# Altium project Fuel_Dispenser_Controller_V1.0.0.PrjPcb (part 2 of 2)

## Sheet Power_Board.SchDoc: MAIN POWER 5V / 3V3 / 1V8
size A2; Date: Not used; ApprovedBy: Not used; CheckedBy: Not used; Author: Not used; CompanyName: STMicroelectronics; DrawnBy: Not used; Engineer: Not used; Organization: Not used; Address1: Not used; Address2: Not used; Address3: Not used; Address4: Not used; DocumentNumber: 9; Revision: Not used; SheetNumber: 5; SheetTotal: 10; CurrentTime: Not used; CurrentDate: Not used; Time: Not used; DocumentFullPathAndName: Not used; DocumentName: Not used; ModifiedDate: Not used; ImagePath: Not used; ProjectName: Not used; Application_BuildNumber: Not used
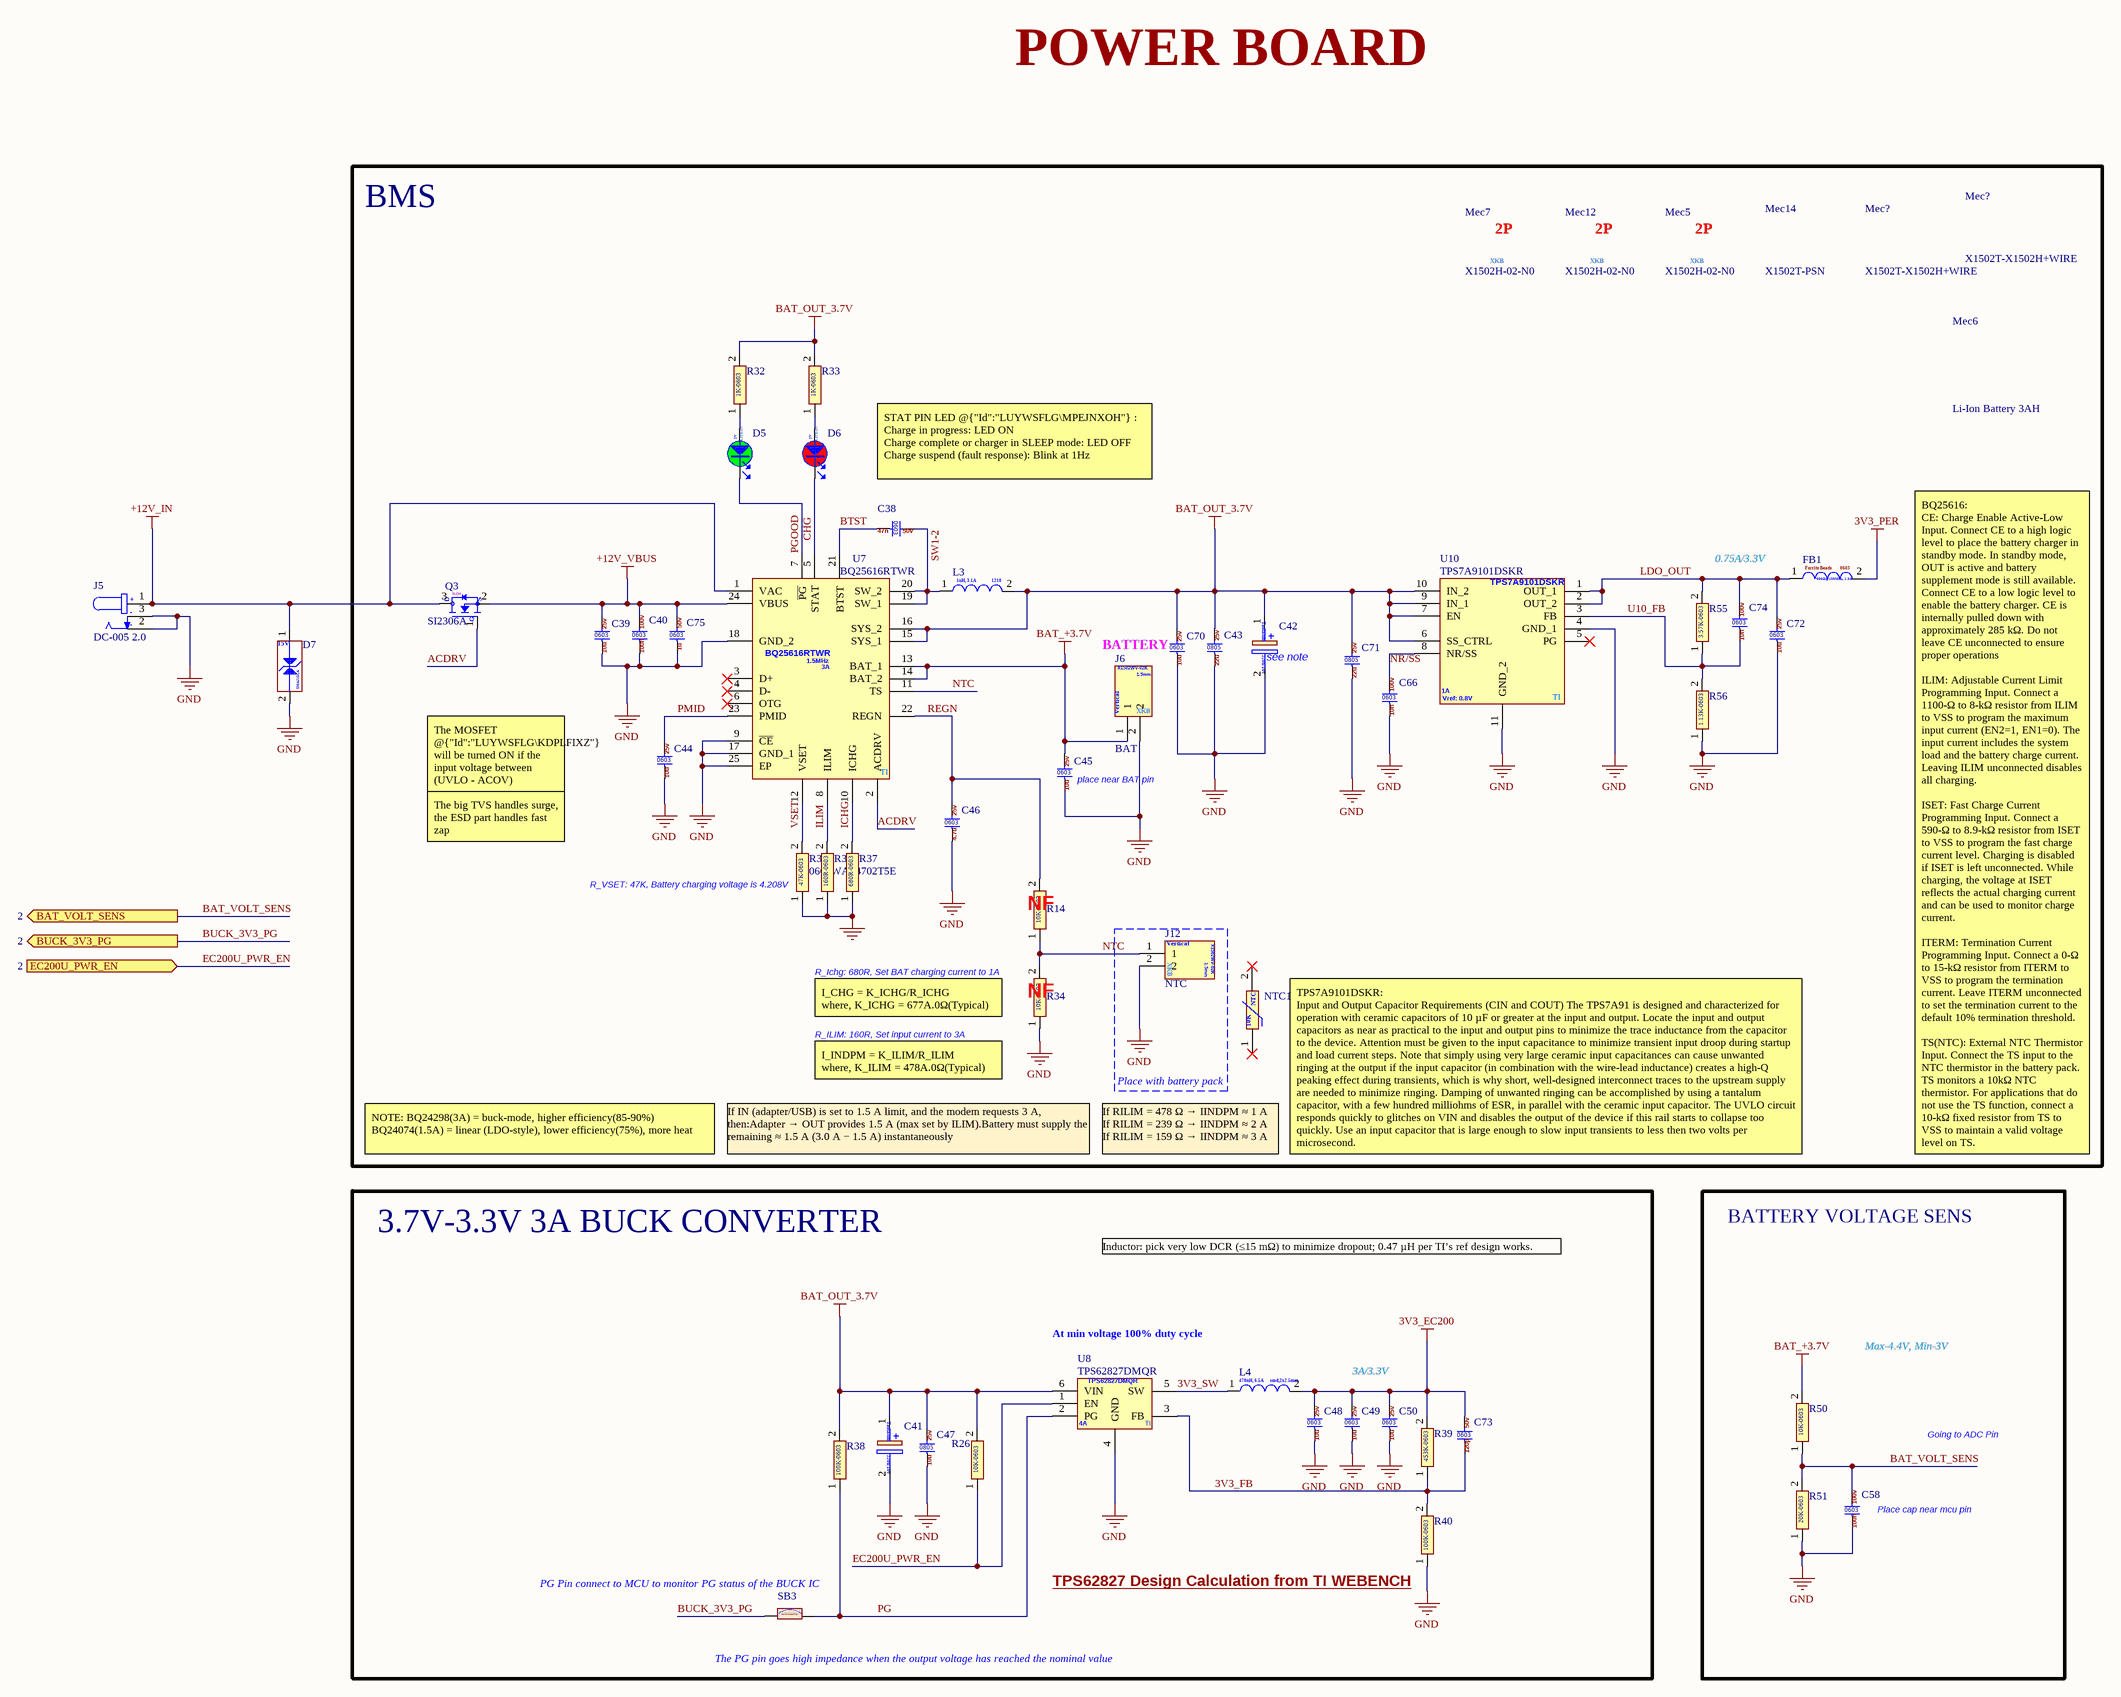
[diagram p5: Power_Board.SchDoc]

### Parts
(Parts that share a designator on the sheet are numbered #1, #2 ... from top to bottom, then left to right.)
C38  CL10B473KB8NNNC  [0603-CAP]  (value not drawn)
C39  CL10A106MA8NRNC  [0603-CAP]  (value not drawn)
C40  CL10B104KC8NNNC  [0603-CAP]  (value not drawn)
C41  TAJD227K010RNJ  [CASE-D-7343]  (value not drawn)
C42  TAJD227K010RNJ  [CASE-D-7343]  (value not drawn)
C43  CL21A226MAQNNNE  [0805-CAP]  (value not drawn)
C44  CL10A106MA8NRNC  [0603-CAP]  (value not drawn)
C45  CL10A106MA8NRNC  [0603-CAP]  (value not drawn)
C46  CL10A475KA8NQNC  [0603-CAP]  (value not drawn)
C47  CL21A106KAYNNNE  [0805-CAP]  (value not drawn)
C48  CL10A106MA8NRNC  [0603-CAP]  (value not drawn)
C49  CL10A106MA8NRNC  [0603-CAP]  (value not drawn)
C50  CL10A106MA8NRNC  [0603-CAP]  (value not drawn)
C58  CL10B104KC8NNNC  [0603-CAP]  (value not drawn)
C66  CL10B103KC8WPNC  [0603-CAP]  (value not drawn)
C70  CL10A106MA8NRNC  [0603-CAP]  (value not drawn)
C71  CL21A226MAQNNNE  [0805-CAP]  (value not drawn)
C72  CL10A106MA8NRNC  [0603-CAP]  (value not drawn)
C73  CL10C121JB81PNC  [0603-CAP]  (value not drawn)
C74  CL10B103KC8WPNC  [0603-CAP]  (value not drawn)
C75  CL10A105KB8NNNC  [0603-CAP]  (value not drawn)
D5  LTST-C170KGKT  [0805-LED-BLUE]  (value not drawn)
D6  LTST-C170KRKT  [0805-LED-RED]  (value not drawn)
D7  SMAJ15CA  [SMA (DO-214AC)]  (value not drawn)
FB1  BLM18KG601SN1D  [Ferrite Beads 0603]  (value not drawn)
J5  DC-005 2.0  [DC JACK]
J6  BAT  [JST 2P 1.5MM VERTICAL]
J12  NTC  [JST 2P 1.5MM VERTICAL]
L3  1277AS-H-1R0M=P2  [IND-1210]  (value not drawn)
L4  FTC252012SR47MBCA  [IND SMD,2x2.5mm]  (value not drawn)
Mec5  X1502H-02-N0  (mechanical)
Mec6  Li-Ion Battery 3AH  (mechanical)
Mec7  X1502H-02-N0  (mechanical)
Mec12  X1502H-02-N0  (mechanical)
Mec14  X1502T-PSN  (mechanical)
Mec?#1  X1502T-X1502H+WIRE  (mechanical)
Mec?#2  X1502T-X1502H+WIRE  (mechanical)
NTC1  NXRT15XH103FA1B030  [NXRT15XH103FA1B030]  (value not drawn)  (mechanical)
Q3  SI2306A  [SOT-23-3]
R14  0603WAF1002T5E  [0603-RES]  (value not drawn)
R26  0603WAF1002T5E  [0603-RES]  (value not drawn)
R32  0603WAF1001T5E  [0603-RES]  (value not drawn)
R33  0603WAF1001T5E  [0603-RES]  (value not drawn)
R34  0603WAF1002T5E  [0603-RES]  (value not drawn)
R35  0603WAF4702T5E  [0603-RES]
R36  0603WAF1600T5E  [0603-RES]  (value not drawn)
R37  0603WAF6800T5E  [0603-RES]  (value not drawn)
R38  0603WAF1003T5E  [0603-RES]  (value not drawn)
R39  0603WAF4533T5E  [0603-RES]  (value not drawn)
R40  0603WAF1003T5E  [0603-RES]  (value not drawn)
R50  0603WAF1002T5E  [0603-RES]  (value not drawn)
R51  0603WAF2002T5E  [0603-RES]  (value not drawn)
R55  0603WAF3571T5E  [0603-RES]  (value not drawn)
R56  0603WAF1131T5E  [0603-RES]  (value not drawn)
SB3  0603WAF0000T5E  [SOLDER-BRIDGE_R0603-0R]  (value not drawn)
U7  BQ25616RTWR  [QFN-24-EP(4x4)]
U8  TPS62827DMQR  [VSON-6(1.5x1.5) - TPS62826DMQR]
U10  TPS7A9101DSKR  [SON-10-EP(2.5x2.5)]

### Blocks framed on the sheet
BMS: C38-C40 C42-C46 C66 C70-C72 C74 C75 D5 D6 FB1 J6 L3 Mec5-Mec7 Mec12 Mec14 Mec?#1 Mec?#2 NTC1 Q3 R14 R32-R37 R55 R56 U7 U10
Place with battery pack: J12
3.7V-3.3V 3A BUCK CONVERTER: C41 C47-C50 C73 L4 R26 R38-R40 SB3 U8
BATTERY VOLTAGE SENS: C58 R50 R51

### Ports
BAT_VOLT_SENS (out, see 2), BUCK_3V3_PG (out, see 2), EC200U_PWR_EN (in, see 2)

### Nets
3V3_EC200: C48.2 C49.2 C50.2 C73.2 L4.2 R39.2
3V3_PER: FB1.2  [project net 3V3_MCU]
+12V_IN: D7.1(IO1) J5.1 Q3.3(D) U7.1(VAC)
+12V_VBUS: C39.2 C40.2 C75.2 Q3.2(S) U7.24(VBUS)
BAT_+3.7V: C45.2 J6.1 R50.2 U7.13(BAT_1) U7.14(BAT_2)
BAT_OUT_3.7V: C41.1(+) C42.1(+) C43.2 C47.2 C70.2 C71.2 L3.2 R26.2 R32.2 R33.2 R38.2 U7.15(SYS_1) U7.16(SYS_2) U8.6(VIN) U10.6(SS_CTRL) U10.7(EN) U10.9(IN_1) U10.10(IN_2)
GND: C39.1 C40.1 C41.2(-) C42.2(-) C43.1 C44.1 C45.1 C46.1 C47.1 C48.1 C49.1 C50.1 C58.1 C66.1 C70.1 C71.1 C72.1 C75.1 D7.2(GND) J5.2 J5.3 J6.2 J12.2 R34.1 R35.1 R36.1 R37.1 R40.1 R51.1 R56.1 U7.9(~{CE}) U7.17(GND_1) U7.18(GND_2) U7.25(EP) U8.4(GND) U10.4(GND_1) U10.11(GND_2)
3V3_FB: C73.1 R39.1 R40.2 U8.3(FB)  [project net 3V3_FB_5]
3V3_SW: L4.1 U8.5(SW)  [project net 3V3_SW_5]
ACDRV: Q3.1(G) U7.2(ACDRV)  [project net ACDRV_5]
BAT_VOLT_SENS: C58.2 R50.1 R51.2 ; port BAT_VOLT_SENS
BTST: C38.1 U7.21(BTST)  [project net BTST_5]
BUCK_3V3_PG: SB3.1 ; port BUCK_3V3_PG
CHG: D6.2 U7.5(STAT)  [project net CHG_5]
EC200U_PWR_EN: R26.1 U8.1(EN) ; port EC200U_PWR_EN
ICHG: R37.2 U7.10(ICHG)  [project net ICHG_5]
ILIM: R36.2 U7.8(ILIM)  [project net ILIM_5]
LDO_OUT: C72.2 C74.2 FB1.1 R55.2 U10.1(OUT_1) U10.2(OUT_2)  [project net LDO_OUT_5]
NR/SS: C66.2 U10.8(NR/SS)  [project net NR/SS_5]
NTC: J12.1 R14.1 R34.2 U7.11(TS)  [project net NTC_5]
PG: R38.1 SB3.2 U8.2(PG)  [project net PG_5]
PGOOD: D5.2 U7.7(~{PG})  [project net PGOOD_5]
PMID: C44.2 U7.23(PMID)  [project net PMID_5]
REGN: C46.2 R14.2 U7.22(REGN)  [project net REGN_5]
SW1-2: C38.2 L3.1 U7.19(SW_1) U7.20(SW_2)  [project net SW1-2_5]
U10_FB: C74.1 R55.1 R56.2 U10.3(FB)  [project net U10_FB_5]
VSET: R35.2 U7.12(VSET)  [project net VSET_5]
NetD5_1: D5.1 R32.1
NetD6_1: D6.1 R33.1

Not connected (* = marked no-connect by the designer): NTC1 1* 2*; U7 3(D+)* 4(D-)* 6(OTG)*; U10 5(PG)*

### Notes on the sheet
- POWER BOARD
- STAT PIN LED @{"Id":"LUYWSFLG\MPEJNXOH"} :
  Charge in progress: LED ON
  Charge complete or charger in SLEEP mode: LED OFF
  Charge suspend (fault response): Blink at 1Hz
- 0.75A/3.3V
- (near C70) BATTERY
- (near C42) see note
- The MOSFET @{"Id":"LUYWSFLG\KDPLFIXZ"} will be turned ON if the input voltage between (UVLO - ACOV)
  ACOV: 14.2-V
- (near C45) place near BAT pin
- The big TVS handles surge, the ESD part handles fast zap
- (near R35) R_VSET: 47K, Battery charging voltage is 4.208V
- (near R14) NF
- (near R34) R_Ichg: 680R, Set BAT charging current to 1A
- (near R34) NF
- R_ILIM: 160R, Set input current to 3A
- (near R34) I_CHG = K_ICHG/R_ICHG
  where, K_ICHG = 677A.0Ω(Typical)
- (near R34) I_INDPM = K_ILIM/R_ILIM
  where, K_ILIM = 478A.0Ω(Typical)
- NOTE: BQ24298(3A) = buck-mode, higher efficiency(85-90%)
  BQ24074(1.5A) = linear (LDO-style), lower efficiency(75%), more heat
- If IN (adapter/USB) is set to 1.5 A limit, and the modem requests 3 A, then:Adapter → OUT provides 1.5 A (max set by ILIM).Battery must supply the remaining ≈ 1.5 A (3.0 A − 1.5 A) instantaneously
- If RILIM = 478 Ω → IINDPM ≈ 1 A
  If RILIM = 239 Ω → IINDPM ≈ 2 A
  If RILIM = 159 Ω → IINDPM ≈ 3 A
- (near NTC1) TPS7A9101DSKR:
  Input and Output Capacitor Requirements (CIN and COUT) The TPS7A91 is designed and characterized for operation with ceramic capacitors of 10 µF or greater at the input and output. Locate the input and output capacitors as near as practical to the input and output pins to minimize the trace inductance from the capacitor to the device. Attention must be given to the input capacitance to minimize transient input droop during startup and load current steps. Note that simply using very large ceramic input capacitances can cause unwanted ringing at the output if the input capacitor (in combination with the wire-lead inductance) creates a high-Q peaking effect during transients, which is why short, well-designed interconnect traces to the upstream supply are needed to minimize ringing. Damping of unwanted ringing can be accomplished by using a tantalum capacitor, with a few hundred milliohms of ESR, in parallel with the ceramic input capacitor. The UVLO circuit responds quickly to glitches on VIN and disables the output of the device if this rail starts to collapse too quickly. Use an input capacitor that is large enough to slow input transients to less then two volts per microsecond.
- BQ25616:
  CE: Charge Enable Active-Low Input. Connect CE to a high logic level to place the battery charger in standby mode. In standby mode, OUT is active and battery supplement mode is still available. Connect CE to a low logic level to enable the battery charger. CE is internally pulled down with approximately 285 kΩ. Do not leave CE unconnected to ensure proper operations
  ILIM: Adjustable Current Limit Programming Input. Connect a 1100-Ω to 8-kΩ resistor from ILIM to VSS to program the maximum input current (EN2=1, EN1=0). The input current includes the system load and the battery charge current. Leaving ILIM unconnected disables all charging.
  ISET: Fast Charge Current Programming Input. Connect a 590-Ω to 8.9-kΩ resistor from ISET to VSS to program the fast charge current level. Charging is disabled if ISET is left unconnected. While charging, the voltage at ISET reflects the actual charging current and can be used to monitor charge current.
  ITERM: Termination Current Programming Input. Connect a 0-Ω to 15-kΩ resistor from ITERM to VSS to program the termination current. Leave ITERM unconnected to set the termination current to the default 10% termination threshold.
  TS(NTC): External NTC Thermistor Input. Connect the TS input to the NTC thermistor in the battery pack. TS monitors a 10kΩ NTC thermistor. For applications that do not use the TS function, connect a 10-kΩ fixed resistor from TS to VSS to maintain a valid voltage level on TS.
- Inductor: pick very low DCR (≤15 mΩ) to minimize dropout; 0.47 µH per TI’s ref design works.
- At min voltage 100% duty cycle
- 3A/3.3V
- Max-4.4V, Min-3V
- Going to ADC Pin
- (near C58) Place cap near mcu pin
- (near SB3) PG Pin connect to MCU to monitor PG status of the BUCK IC
- (near R40) TPS62827 Design Calculation from TI WEBENCH <https://webench.ti.com/power-designer/switching-regulator/customize/15>
- (near SB3) The PG pin goes high impedance when the output voltage has reached the nominal value
- Title:
- Project:
- Size:
- Revision:
- Variant:
- A4
- -
- Date:
- Reference:
- Sheet:
- of
- (in symbol 0603WAF1001T5E) 1K-0603
- (in symbol 0603WAF1002T5E) 10K-0603
- (in symbol 0603WAF1003T5E) 100K-0603
- (in symbol 0603WAF1131T5E) 1.13K-0603
- (in symbol 0603WAF1600T5E) 160R-0603
- (in symbol 0603WAF2002T5E) 20K-0603
- (in symbol 0603WAF3571T5E) 3.57K-0603
- (in symbol 0603WAF4533T5E) 453K-0603
- (in symbol 0603WAF4702T5E) 47K-0603
- (in symbol 0603WAF6800T5E) 680R-0603
- (in symbol 1277AS-H-1R0M=P2) 1uH, 3.1A; 1210
- (in symbol BLM18KG601SN1D) Ferrite Beads; 0603; 600Ω@100MHz, 1.3A
- (in symbol BQ25616RTWR) 1.5MHz; 3A; TI
- (in symbol CL10A105KB8NNNC) 50v; 0603; 1u
- (in symbol CL10A106MA8NRNC) 25v; 0603; 10u
- (in symbol CL10A475KA8NQNC) 25v; 0603; 4.7u
- (in symbol CL10B103KC8WPNC) 100v; 0603; 10n
- (in symbol CL10B104KC8NNNC) 100v; 0603; 100n
- (in symbol CL10B473KB8NNNC) 0603; 47n; 50v
- (in symbol CL10C121JB81PNC) 50v; 0603; 120p
- (in symbol CL21A106KAYNNNE) 25v; 0805; 10u
- (in symbol CL21A226MAQNNNE) 25v; 0805; 22u
- (in symbol DC-005 2.0) +; -
- (in symbol FTC252012SR47MBCA) 470nH, 6.5A; smd,2x2.5mm
- (in symbol LTST-C170KGKT) 2V; LITEON
- (in symbol LTST-C170KRKT) 2V; LITEON
- (in symbol NXRT15XH103FA1B030) NTC; 10K
- (in symbol SI2306A) N-CH
- (in symbol SMAJ15CA) 15V
- (in symbol TAJD227K010RNJ) Tantalum; 220u/10v
- (in symbol TPS7A9101DSKR) 1A; Vref: 0.8V; TI
- (in symbol TPS62827DMQR) 4A; TI
- (in symbol X1502H-02-N0) 2P; XKB
- (in symbol X1502WV-02K-N0SN) X1502WV-02K; 1.5mm; Vertical; XKB

### Library data of the parts
C38 = CL10B473KB8NNNC: CAP: CER 47NF 50V X7R 0603; POC Price: 0.0051; LCSC Part #: C1622; Unit Price: 0.0031; ComponentLink1Description: DS; ComponentLink1URL: https://www.lcsc.com/datasheet/C1588.pdf
C39 C44 C45 C48-C50 C70 C72 = CL10A106MA8NRNC: CAP: CER 10UF 25V X5R 0603; LCSC Part #: C96446; Unit Price: 0.01; ComponentLink1Description: DS; ComponentLink1URL: https://www.lcsc.com/datasheet/C96446.pdf
C40 C58 = CL10B104KC8NNNC: as C3 on sheet MCU; LCSC Part #: C15725; Unit Price: 0.0036; ComponentLink1Description: DS; ComponentLink1URL: https://www.lcsc.com/datasheet/C15725.pdf
C41 C42 = TAJD227K010RNJ: CAP: TANT 220uF ±10% 10V CASE-D-7343; POC Price: 0.3941; LCSC Part #: C8024; Unit Price: 0.2118
C43 C71 = CL21A226MAQNNNE: CAP: CER 22UF 25V X5R 0805; LCSC Part #: C45783; Unit Price: 0.0136
C46 = CL10A475KA8NQNC: CAP: CER 4.7UF 25V X5R 0603; POC Price: 0.0167; LCSC Part #: C69335; Unit Price: 0.009; ComponentLink1Description: DS; ComponentLink1URL: https://www.lcsc.com/datasheet/C69335.pdf
C47 = CL21A106KAYNNNE: CAP: CER 10UF 25V X5R 0805; LCSC Part #: C15850; Unit Price: 0.0059
C66 C74 = CL10B103KC8WPNC: CAP: CER 10NF 100V X7R 0603; LCSC Part #: C307347; Unit Price: 0.0046
C73 = CL10C121JB81PNC: CAP: CER 120PF 50V C0G 0603; POC Price: 0.011; LCSC Part #: C444883; Unit Price: 0.0048
C75 = CL10A105KB8NNNC: CAP: CER 1UF 50V X5R 0603; LCSC Part #: C15849; Unit Price: 0.0026
D5 = LTST-C170KGKT: as D4 on sheet miniPCIe_EC200U; LCSC Part #: C98221; Unit Price: 0.0095; ComponentLink1Description: DS; ComponentLink1URL: https://www.lcsc.com/datasheet/C98221.pdf
D6 = LTST-C170KRKT: as D3 on sheet miniPCIe_EC200U; LCSC Part #: C94868; Unit Price: 0.0107
D7 = SMAJ15CA: DIODE ESD: 16.4A@10/1000us 400W@10/1000us 24.4V 18.5V Bidirectional 15V DO-214AC(SMA) ESD and Surge Protection (TVS/ESD) ROHS; POC Price: 0.0378; LCSC Part #: C110044; Unit Price: 0.0178; ComponentLink1Description: DS; ComponentLink1URL: https://www.lcsc.com/datasheet/C110044.pdf
FB1 = BLM18KG601SN1D: Ferrite Beads: 150mΩ 600Ω@100MHz 1.3A muRata; POC Price: 0.0113; LCSC Part #: C85833; Unit Price: 0.0059; ComponentLink1Description: DS; ComponentLink1URL: https://www.lcsc.com/datasheet/C85833.pdf
J5 = DC-005 2.0: CONN: Right Angle DC Power Jack -25℃~+85℃ 2mm 6.4mm 1A 12V Through Hole DC Power Connectors ROHS; LCSC Part #: C16214
J6 J12 = X1502WV-02K-N0SN: JST: Vertical, P1.5mm TH, 2P, Wire To Board Connector, 1A (Housing: X1502H-02-N0 - C697053); POC Price: 0.0156; LCSC Part #: C561525; Unit Price: 0.0071; ComponentLink1Description: DS; ComponentLink1URL: https://www.lcsc.com/datasheet/C561525.pdf
L3 = 1277AS-H-1R0M=P2: INDUCTOR: 1uH 3.1A 45mΩ 1210 FIXED IND; POC Price: 0.1051; LCSC Part #: C237284; ComponentLink1Description: DS; ComponentLink1URL: https://www.lcsc.com/datasheet/C237284.pdf; Unit Price: 0.0566
L4 = FTC252012SR47MBCA: INDUCTOR: FIXED IND 0.47uH 6.5A 13mΩ SMD,2x2.5mm; POC Price: 0.0806; LCSC Part #: C5832368; Unit Price: 0.0393; ComponentLink1Description: DS; ComponentLink1URL: https://www.lcsc.com/datasheet/C167222.pdf
Mec5 Mec7 Mec12 = X1502H-02-N0: JST Housing: P1.5mm, 2P, Wire To Board; POC Price: 0.0042; LCSC Part #: C697053; Unit Price: 0.0036; ComponentLink1Description: DS; ComponentLink1URL: https://www.lcsc.com/datasheet/C697053.pdf
Mec6 = Li-Ion Battery 3AH: Battery: Li ion, Li-ion 3ah; Parameter 1: *
Mec14 = X1502T-PSN: Con: Rectangular Connector Contacts ROHS; JST; HOUSING; P1.5mm; 2P; 3P; 4P; WIRE TO BOARD; X1502H; X1503H; X1504H; X1505H; X1506H; X1502T; X1503T; X1504T; X1505T; X1506T; POC Price: 0.005; LCSC Part #: C780064; Unit Price: 0.0024; ComponentLink1Description: DS; ComponentLink1URL: https://www.lcsc.com/datasheet/C780064.pdf
Mec?#1 Mec?#2 = X1502T-PSN-A28RB-L100-T3: Hook-Up Wire: Housing+contact; Single Conductor Cables (Hook-Up Wire); JST; HOUSING; P1.5mm; 2P; WIRE TO BOARD; X1502H; X1502T; 28 AWG; POC Price: 0.0789; LCSC Part #: C6118644; Unit Price: 0.0727; ComponentLink1Description: DS
NTC1 = NXRT15XH103FA1B030: NTC: 10kΩ 7.5mW 3380K ±1% Through Hole,P=2.5mm NTC Thermistors ROHS; POC Price: 0.3195; ComponentLink1Description: DS; ComponentLink1URL: https://componentsearchengine.com/Datasheets/1/NXRT15XH103FA1B030.pdf; LCSC Part #: C152559; Unit Price: 0.1511
Q3 = SI2306A: MOSFET: N-CH 30V 4A 1.25W 35mΩ@10V 3V@250uA 1 N-Channel SOT-23 MOSFETs ROHS; LCSC Part #: C347489; Unit Price: 0.0155
R14 R26 R34 R50 = 0603WAF1002T5E: RES: 10K OHM 1% 100mW 0603 75V; LCSC Part #: C25804; Unit Price: 0.0005; ComponentLink1Description: DS; ComponentLink1URL: https://www.lcsc.com/datasheet/C25804.pdf
R32 R33 = 0603WAF1001T5E: RES: 1K OHM 1% 100mW 0603 75V; LCSC Part #: C21190; Unit Price: 0.0005; ComponentLink1Description: DS; ComponentLink1URL: https://www.lcsc.com/datasheet/C21190.pdf
R35 = 0603WAF4702T5E: RES: 47K OHM 1% 100mW 0603 75V; LCSC Part #: C25819; Unit Price: 0.0006; ComponentLink1Description: DS; ComponentLink1URL: https://www.lcsc.com/datasheet/C25819.pdf
R36 = 0603WAF1600T5E: RES: 160R OHM 1% 100mW 0603 75V; POC Price: 0.0011; LCSC Part #: C22814; Unit Price: 0.0006; ComponentLink1Description: DS; ComponentLink1URL: https://www.lcsc.com/datasheet/C22787.pdf
R37 = 0603WAF6800T5E: RES: 680R OHM 1% 100mW 0603 75V; POC Price: 0.0011; LCSC Part #: C23228; Unit Price: 0.0006; ComponentLink1Description: DS; ComponentLink1URL: https://www.lcsc.com/datasheet/C22787.pdf
R38 R40 = 0603WAF1003T5E: RES: 100K OHM 1% 100mW 0603 75V; LCSC Part #: C25803; Unit Price: 0.0006; ComponentLink1Description: DS; ComponentLink1URL: https://www.lcsc.com/datasheet/C25803.pdf
R39 = 0603WAF4533T5E: RES: 453K OHM 1% 100mW 0603 75V; POC Price: 0.001; LCSC Part #: C25818; Unit Price: 0.0005; ComponentLink1Description: DS; ComponentLink1URL: https://www.lcsc.com/datasheet/C25818.pdf
R51 = 0603WAF2002T5E: RES: 20K OHM 1% 100mW 0603 75V; LCSC Part #: C4184; Unit Price: 0.0006; ComponentLink1Description: DS; ComponentLink1URL: https://www.lcsc.com/datasheet/C4184.pdf
R55 = 0603WAF3571T5E: RES: 3.57K OHM 1% 100mW 0603 75V; POC Price: 0.001; LCSC Part #: C22998; Unit Price: 0.0005; ComponentLink1Description: DS; ComponentLink1URL: https://www.lcsc.com/datasheet/C22998.pdf
R56 = 0603WAF1131T5E: RES: 1.13K OHM 1% 100mW 0603 75V; POC Price: 0.0011; LCSC Part #: C22833; Unit Price: 0.0006; ComponentLink1Description: DS; ComponentLink1URL: https://www.lcsc.com/datasheet/C22833.pdf
SB3 = 0603WAF0000T5E: Solder Bridge: ON SB 0603; LCSC Part #: C21189; Unit Price: 0.0006; ComponentLink1Description: DS; ComponentLink1URL: https://www.lcsc.com/datasheet/C21189.pdf
U7 = BQ25616RTWR: BMS: 4V~13.5V Lithium Battery 1 3A QFN-24-EP(4x4) Battery Management ROHS; POC Price: 0.6499; ComponentLink1Description: DS; ComponentLink1URL: https://www.lcsc.com/datasheet/C2866447.pdf; LCSC Part #: C2866447; Unit Price: 0.3173
U8 = TPS62827DMQR: SMPS BUCK: 2.4V to 5.5V input, 4A step-down converter; POC Price: 0.5713; ComponentLink1Description: DS; ComponentLink1URL: https://www.ti.com/lit/gpn/tps62827; LCSC Part #: C2071448; Unit Price: 0.5436
U10 = TPS7A9101DSKR: LDO: 39dB@(500kHz) 1A Adjustable 800mV~5.2V Positive 6.5V SON-10-EP(2.5x2.5) Voltage Regulators - Linear, Low Drop Out (LDO) Regulators ROHS; POC Price: 0.5248; ComponentLink1Description: DS; ComponentLink1URL: http://www.ti.com/lit/ds/symlink/tps7a91.pdf; LCSC Part #: C2878140; Unit Price: 0.2563

## Sheet RS485_MODBUS.SchDoc: MODBUS RS485
size A4; Date: *******; ApprovedBy: *******; CheckedBy: None; Author: *******; CompanyName: *******; DrawnBy: Name; Engineer: *******; Organization: *******; Address1: *******; Address2: *******; Address3: *******; Address4: *******; DocumentNumber: Doc Num; Revision: *******; SheetNumber: 6; SheetTotal: 10; CurrentTime: *******; CurrentDate: *******; Time: *******; DocumentFullPathAndName: *******; DocumentName: *******; ModifiedDate: *******; ImagePath: *******; ProjectName: *******; Application_BuildNumber: *******
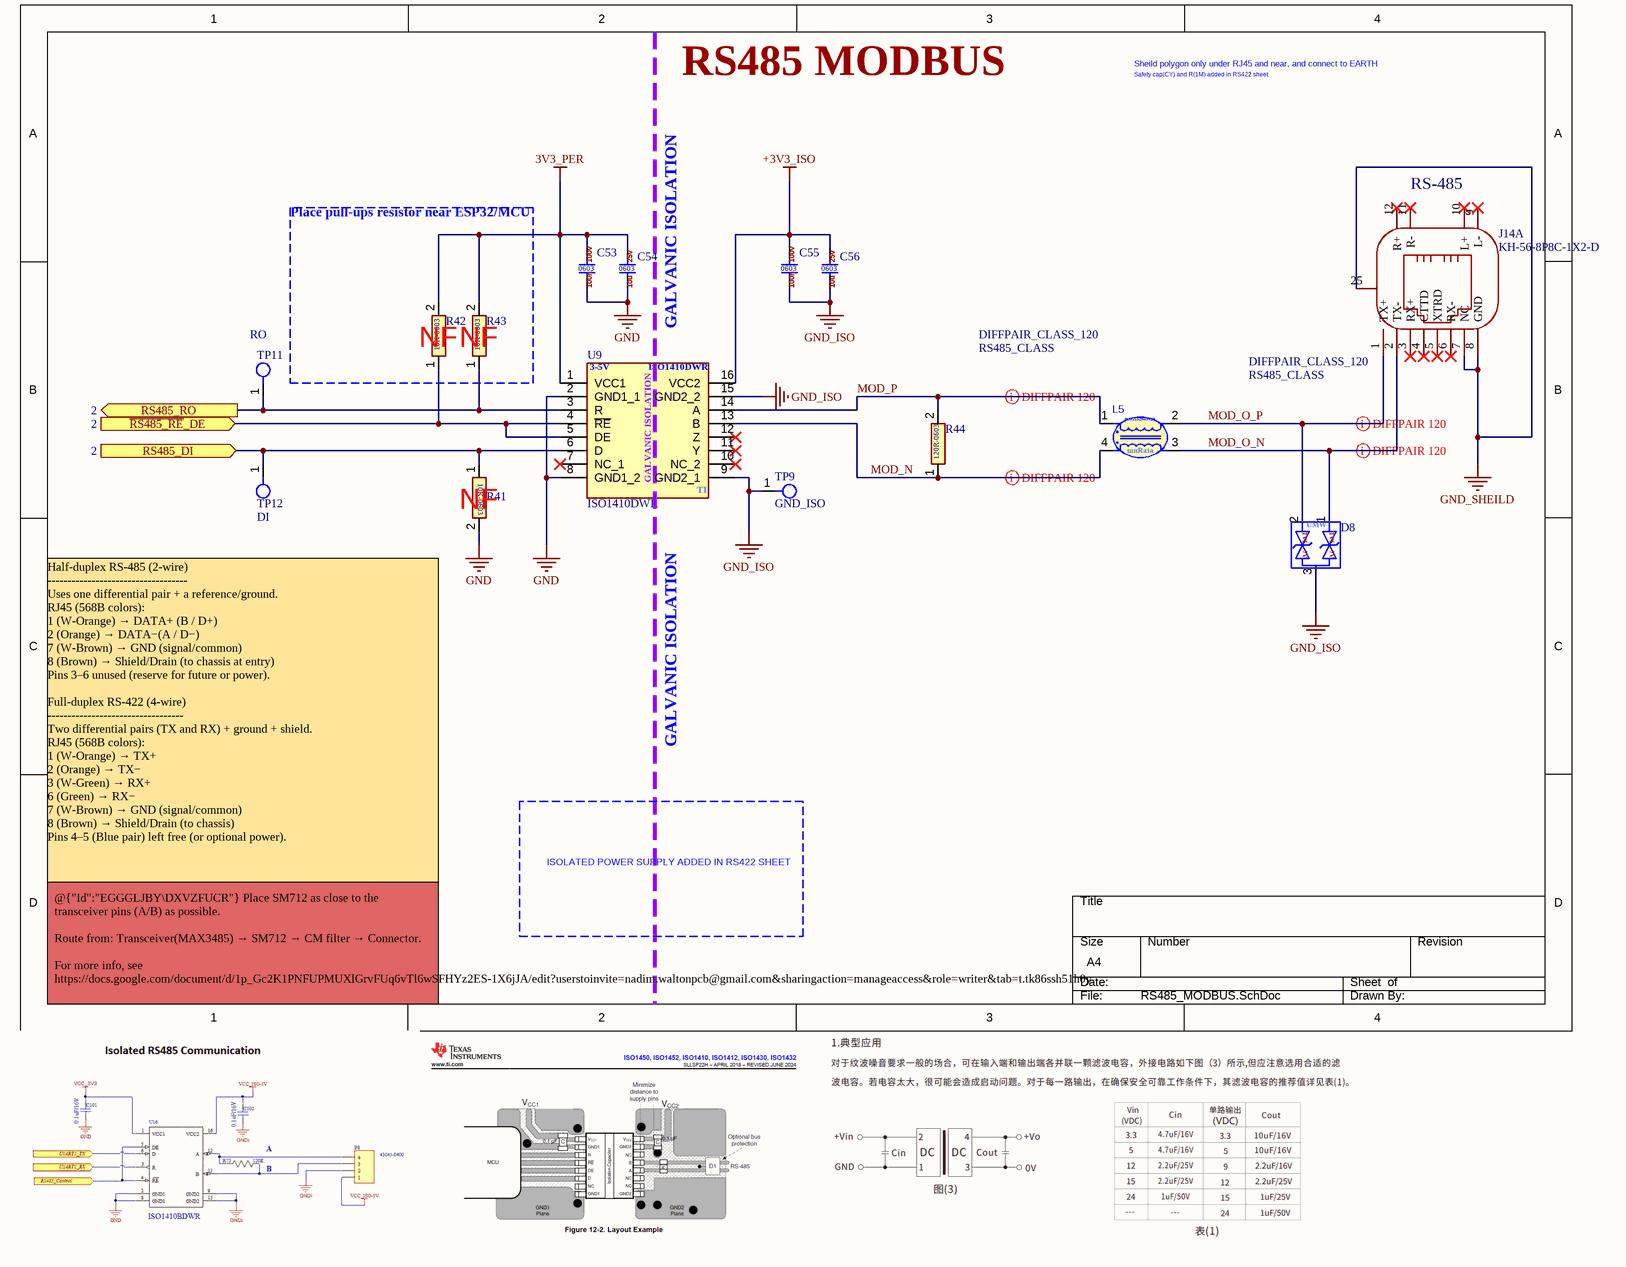
[diagram p6: RS485_MODBUS.SchDoc]

### Parts
C53  CL10B104KC8NNNC  [0603-CAP]  (value not drawn)
C54  CL10A106MA8NRNC  [0603-CAP]  (value not drawn)
C55  CL10B104KC8NNNC  [0603-CAP]  (value not drawn)
C56  CL10A106MA8NRNC  [0603-CAP]  (value not drawn)
D8  SM712(UMW)  [SOT-23-3]  (value not drawn)
J14  KH-56-8P8C-1X2-D  [RJ45-TH_KH-56-8P8C-1X2-D]  (part A of 2)
L5  DLW21SZ900HQ2L  [FILTER-SMD_4P-L2.0-W1.2-BL_DLW21H]  (value not drawn)
R41  0603WAF1002T5E  [0603-RES]  (value not drawn)
R42  0603WAF1002T5E  [0603-RES]  (value not drawn)
R43  0603WAF1002T5E  [0603-RES]  (value not drawn)
R44  0603WAF1200T5E  [0603-RES]  (value not drawn)
TP9  GND_ISO  [Test Pad FP]
TP11  RO  [Test Pad FP]
TP12  DI  [Test Pad FP]
U9  ISO1410DWR  [SOIC-16-300mil]

### Ports
RS485_DI (in, see 2), RS485_RO (out, see 2), ~{RS485_RE}_DE (in, see 2)

### Nets
3V3_PER: C53.2 C54.2 R42.2 R43.2 U9.1(VCC1)  [project net 3V3_MCU]
+3V3_ISO: C55.2 C56.2 U9.16(VCC2)
GND: C53.1 C54.1 R41.2 U9.2(GND1_1) U9.8(GND1_2)
GND_ISO: C55.1 C56.1 D8.3 TP9.1 U9.9(GND2_1) U9.15(GND2_2)
GND_SHEILD: J14.7(NC) J14.8(GND) J14.25(SHELL)
MOD_N: L5.4 R44.1 U9.13(B)  [project net MOD_N_6]
MOD_O_N: D8.1 J14.2(TX-) L5.3  [project net MOD_O_N_6]
MOD_O_P: D8.2 J14.1(TX+) L5.2  [project net MOD_O_P_6]
MOD_P: L5.1 R44.2 U9.14(A)  [project net MOD_P_6]
~{RS485_RE}_DE: R42.1 U9.4(~{RE}) U9.5(DE) ; port ~{RS485_RE}_DE
RS485_DI: R41.1 TP12.1 U9.6(D) ; port RS485_DI
RS485_RO: R43.1 TP11.1 U9.3(R) ; port RS485_RO

Not connected (* = marked no-connect by the designer): J14 3(RX+)* 4(CTTD)* 5(XTRD)* 6(RX-)* 9(L-)* 10(L+)* 11(R-)* 12(R+)*; U9 7(NC_1)* 10(NC_2)* 11(Y)* 12(Z)*

### Layout directives
differential pair; differential pair class DIFFPAIR_CLASS_120; net class RS485_CLASS; rule Matched Net Lengths [Tolerance = 0.5mm]: MOD_N_6, MOD_O_N_6, MOD_O_P_6, MOD_P_6

### Notes on the sheet
- RS485 MODBUS
- Sheild polygon only under RJ45 and near, and connect to EARTH
- Safety cap(CY) and R(1M) added in RS422 sheet
- Place pull-ups resistor near ESP32/MCU
- (near J14) RS-485
- (near R42) NF
- (near R43) NF
- GALVANIC ISOLATION
- (near R41) NF
- Half-duplex RS-485 (2-wire)
  -----------------------------------
  Uses one differential pair + a reference/ground.
  RJ45 (568B colors):
  1 (W-Orange) → DATA+ (B / D+)
  2 (Orange) → DATA−(A / D−)
  7 (W-Brown) → GND (signal/common)
  8 (Brown) → Shield/Drain (to chassis at entry)
  Pins 3–6 unused (reserve for future or power).
  Full-duplex RS-422 (4-wire)
  ----------------------------------
  Two differential pairs (TX and RX) + ground + shield.
  RJ45 (568B colors):
  1 (W-Orange) → TX+
  2 (Orange) → TX−
  3 (W-Green) → RX+
  6 (Green) → RX−
  7 (W-Brown) → GND (signal/common)
  8 (Brown) → Shield/Drain (to chassis)
  Pins 4–5 (Blue pair) left free (or optional power).
- ISOLATED POWER SUPPLY ADDED IN RS422 SHEET
- @{"Id":"EGGGLJBY\DXVZFUCR"} Place SM712 as close to the transceiver pins (A/B) as possible.
  Route from: Transceiver(MAX3485) → SM712 → CM filter → Connector.
  For more info, see https://docs.google.com/document/d/1p_Gc2K1PNFUPMUXlGrvFUq6vTl6wSFHYz2ES-1X6jJA/edit?userstoinvite=nadim.waltonpcb@gmail.com&sharingaction=manageaccess&role=writer&tab=t.tk86ssh51h0y
- DWG. NO.
- REV.
- SHT.
- THIS DOCUMENT AND THE DATA DISCLOSED HEREIN OR HEREWITH IS THE PROPERTY OF ALTIUM LIMITED AND MAY BE FREELY DISTRIBUTED IN WHOLE. NO RIGHTS ARE RESERVED OR EXPRESS OR IMPLIED WARANTEE GIVEN.
- REVISION
- DESCRIPTION
- DATE
- APPROVED
- ENG:
- APPROVALS
- PROJECT
- DSN:
- CHK:
- REFERENCE DOCUMENTS
- PROJECT REVISION:
- TITLE
- DOCUMENT REVISION:
- DESIGN ITEM:
- BOM:
- FAB DWG:
- PCB DWG:
- ASSY DWG:
- SCALE:
- SIZE
- B
- CAGE CODE
- FILE NAME
- DWG NO.
- SHEET
- OF
- REV
- (in symbol 0603WAF1002T5E) 10K-0603
- (in symbol 0603WAF1200T5E) 120R-0603
- (in symbol CL10A106MA8NRNC) 25v; 0603; 10u
- (in symbol CL10B104KC8NNNC) 100v; 0603; 100n
- (in symbol DLW21SZ900HQ2L) muRata
- (in symbol ISO1410DWR) 3-5V; GALVANIC ISOLATION; TI
- (in symbol SM712(UMW)) TVS; UMW; 7V

### Library data of the parts
C53 C55 = CL10B104KC8NNNC: CAP: CER 100NF 100V X7R 0603; POC Price: 0.006; LCSC Part #: C15725; Unit Price: 0.0036; ComponentLink1Description: DS; ComponentLink1URL: https://www.lcsc.com/datasheet/C15725.pdf
C54 C56 = CL10A106MA8NRNC: CAP: CER 10UF 25V X5R 0603; LCSC Part #: C96446; Unit Price: 0.01; ComponentLink1Description: DS; ComponentLink1URL: https://www.lcsc.com/datasheet/C96446.pdf
D8 = SM712(UMW): DIODE TVS: 7V WM 11VC Voltage - Breakdown (Min) 6V / SOT-23; LCSC Part #: C7436899; Unit Price: 0.0183; ComponentLink1Description: DS; ComponentLink1URL: https://www.lcsc.com/datasheet/C7436899.pdf
J14 = KH-56-8P8C-1X2-D_1: RJ45: RJ45 Jack 2 Shielded Right Angle With LED 0℃~+70℃ Through Hole,Right Angle Ethernet Connectors / Modular Connectors (RJ45 RJ11) ROHS; LCSC Part #: C2828088; Unit Price: 0.3505; ComponentLink1Description: DS; ComponentLink1URL: https://www.lcsc.com/datasheet/C2828088.pdf
L5 = DLW21SZ900HQ2L: Filter CM: 90Ω@100MHz 410mΩ 2 0805 Common Mode Filters ROHS; POC Price: 0.1002; LCSC Part #: C161093; Unit Price: 0.0475; ComponentLink1Description: DS; ComponentLink1URL: https://www.lcsc.com/datasheet/C161093.pdf
R41-R43 = 0603WAF1002T5E: RES: 10K OHM 1% 100mW 0603 75V; LCSC Part #: C25804; Unit Price: 0.0005; ComponentLink1Description: DS; ComponentLink1URL: https://www.lcsc.com/datasheet/C25804.pdf
R44 = 0603WAF1200T5E: RES: 120R OHM 1% 100mW 0603 75V; LCSC Part #: C22787; Unit Price: 0.0006; ComponentLink1Description: DS; ComponentLink1URL: https://www.lcsc.com/datasheet/C22787.pdf
TP9 TP11 TP12 = Test Pad: TESTPAD: Test Pad
U9 = ISO1410DWR: MODBUS: Galvanic Isolated 3-5V Full and Half-Duplex RS-485 RS-422 Transceivers; POC Price: 3.5376; LCSC Part #: C2671566; Unit Price: 2.1999; ComponentLink1Description: DS; ComponentLink1URL: https://www.ti.com/lit/ds/symlink/iso1410.pdf?ts=1756305081744&ref_url=https%253A%252F%252Fwww.ti.com%252Fproduct%252FISO1410%252Fpart-details%252FISO1410DWR

## Sheet RS422_point_to_point.SchDoc: MODBUS RS485
size A4; Date: *******; ApprovedBy: *******; CheckedBy: None; Author: *******; CompanyName: *******; DrawnBy: Name; Engineer: *******; Organization: *******; Address1: *******; Address2: *******; Address3: *******; Address4: *******; DocumentNumber: Doc Num; Revision: *******; SheetNumber: 7; SheetTotal: 10; CurrentTime: *******; CurrentDate: *******; Time: *******; DocumentFullPathAndName: *******; DocumentName: *******; ModifiedDate: *******; ImagePath: *******; ProjectName: *******; Application_BuildNumber: *******
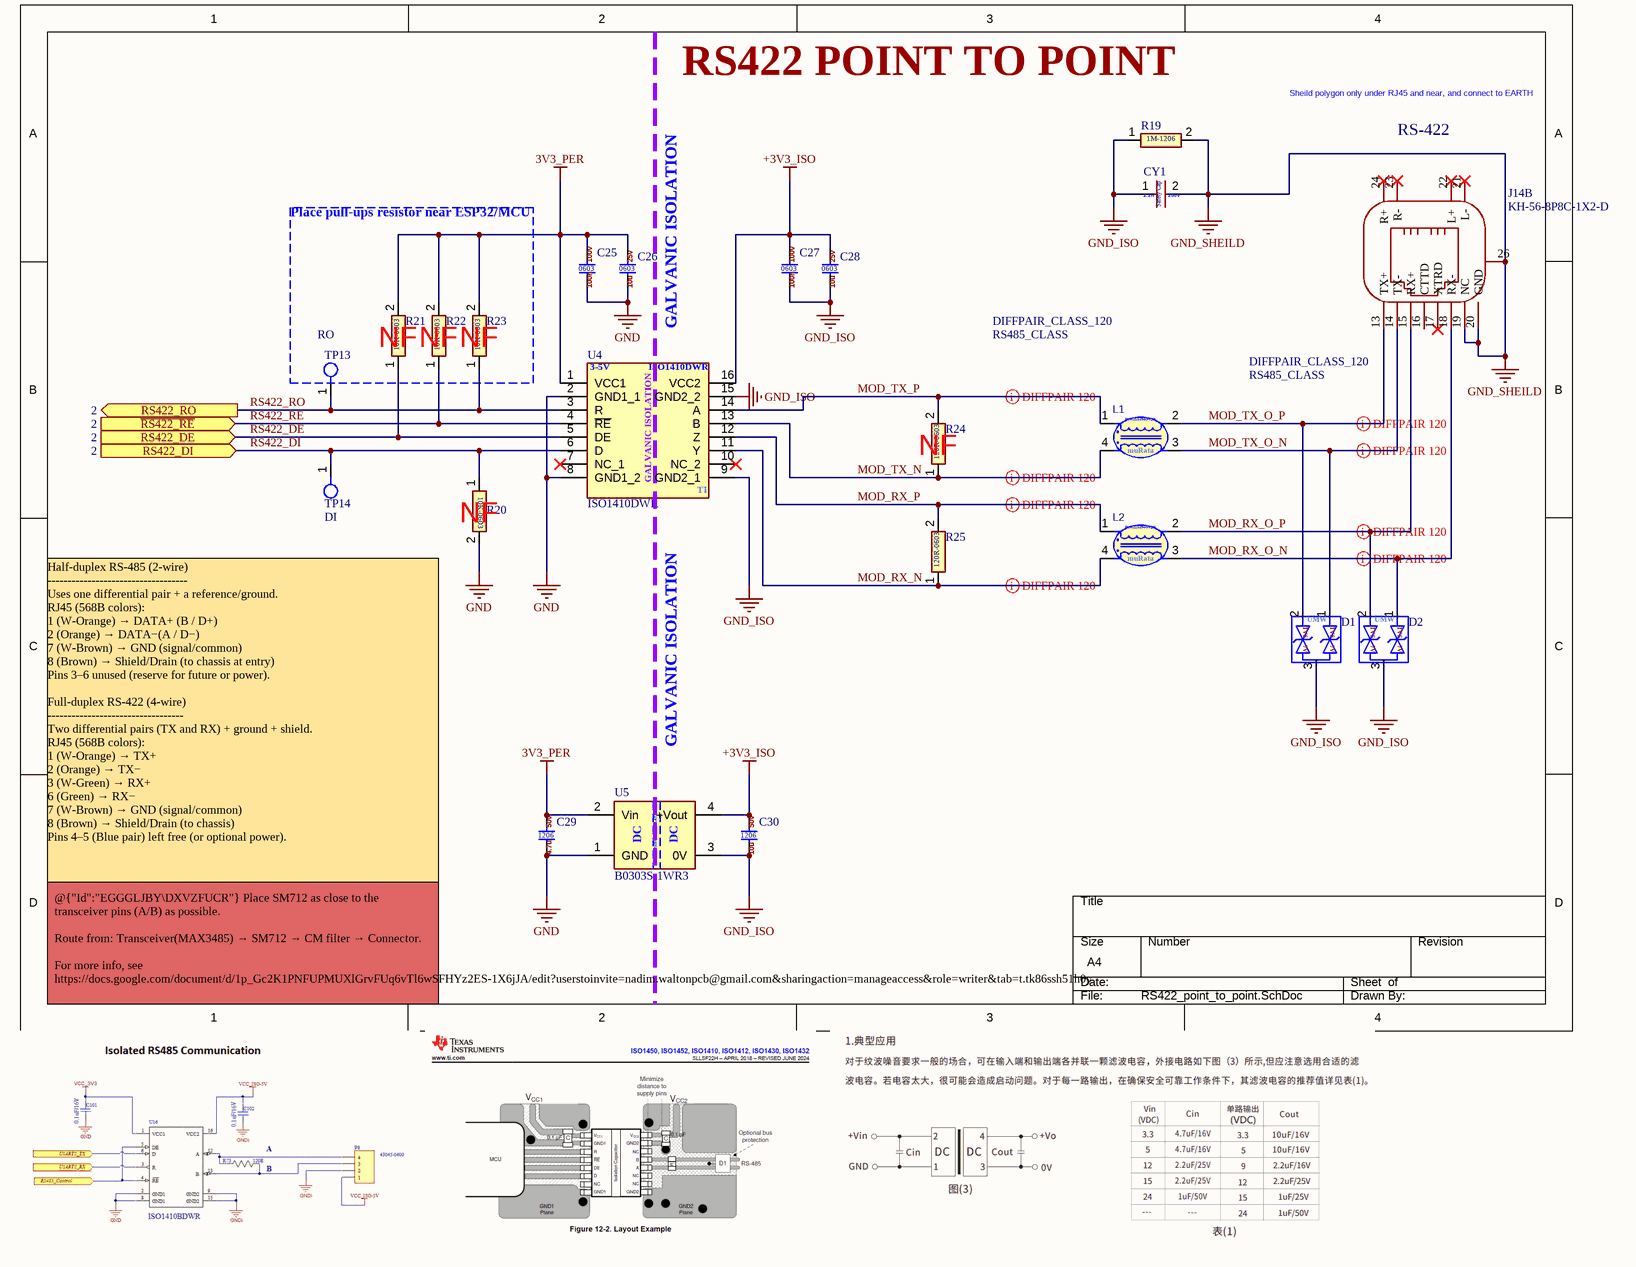
[diagram p7: RS422_point_to_point.SchDoc]

### Parts
C25  CL10B104KC8NNNC  [0603-CAP]  (value not drawn)
C26  CL10A106MA8NRNC  [0603-CAP]  (value not drawn)
C27  CL10B104KC8NNNC  [0603-CAP]  (value not drawn)
C28  CL10A106MA8NRNC  [0603-CAP]  (value not drawn)
C29  CL31B475KBHNNNE  [1206-CAP]  (value not drawn)
C30  CL31A106KBHNNNE  [1206-CAP]  (value not drawn)
CY1  G08F1E222MN0B0S0N0  [CAP_SAFETY_P7.5MM]  (value not drawn)
D1  SM712(UMW)  [SOT-23-3]  (value not drawn)
D2  SM712(UMW)  [SOT-23-3]  (value not drawn)
J14  KH-56-8P8C-1X2-D  [RJ45-TH_KH-56-8P8C-1X2-D]  (part B of 2)
L1  DLW21SZ900HQ2L  [FILTER-SMD_4P-L2.0-W1.2-BL_DLW21H]  (value not drawn)
L2  DLW21SZ900HQ2L  [FILTER-SMD_4P-L2.0-W1.2-BL_DLW21H]  (value not drawn)
R19  1206W4F1004T5E  [1206-RES]  (value not drawn)
R20  0603WAF1002T5E  [0603-RES]  (value not drawn)
R21  0603WAF1002T5E  [0603-RES]  (value not drawn)
R22  0603WAF1002T5E  [0603-RES]  (value not drawn)
R23  0603WAF1002T5E  [0603-RES]  (value not drawn)
R24  0603WAF1200T5E  [0603-RES]  (value not drawn)
R25  0603WAF1200T5E  [0603-RES]  (value not drawn)
TP13  RO  [Test Pad FP]
TP14  DI  [Test Pad FP]
U4  ISO1410DWR  [SOIC-16-300mil]
U5  B0303S-1WR3  [EVISUN B0303S-1WR3]

### Ports
RS422_DE (in, see 2), RS422_DI (in, see 2), RS422_RO (out, see 2), ~{RS422_RE} (in, see 2)

### Nets
3V3_PER: C25.2 C26.2 C29.2 R21.2 R22.2 R23.2 U4.1(VCC1) U5.2(Vin)  [project net 3V3_MCU]
+3V3_ISO: C27.2 C28.2 C30.2 U4.16(VCC2) U5.4(+Vout)
GND: C25.1 C26.1 C29.1 R20.2 U4.2(GND1_1) U4.8(GND1_2) U5.1(GND)
GND_ISO: C27.1 C28.1 C30.1 CY1.1 D1.3 D2.3 R19.1 U4.9(GND2_1) U4.15(GND2_2) U5.3(0V)
GND_SHEILD: CY1.2 J14.19(NC) J14.20(GND) J14.26(SHELL) R19.2
MOD_RX_N: L2.4 R25.1 U4.11(Y)  [project net MOD_RX_N_7]
MOD_RX_O_N: D2.1 J14.18(RX-) L2.3  [project net MOD_RX_O_N_7]
MOD_RX_O_P: D2.2 J14.15(RX+) L2.2  [project net MOD_RX_O_P_7]
MOD_RX_P: L2.1 R25.2 U4.12(Z)  [project net MOD_RX_P_7]
MOD_TX_N: L1.4 R24.1 U4.13(B)  [project net MOD_TX_N_7]
MOD_TX_O_N: D1.1 J14.14(TX-) L1.3  [project net MOD_TX_O_N_7]
MOD_TX_O_P: D1.2 J14.13(TX+) L1.2  [project net MOD_TX_O_P_7]
MOD_TX_P: L1.1 R24.2 U4.14(A)  [project net MOD_TX_P_7]
RS422_DE: R21.1 U4.5(DE) ; port RS422_DE
RS422_DI: R20.1 TP14.1 U4.6(D) ; port RS422_DI
RS422_RE: R22.1 U4.4(~{RE}) ; port ~{RS422_RE}
RS422_RO: R23.1 TP13.1 U4.3(R) ; port RS422_RO

Not connected (* = marked no-connect by the designer): J14 16(CTTD) 17(XTRD)* 21(L-)* 22(L+)* 23(R-)* 24(R+)*; U4 7(NC_1)* 10(NC_2)*

### Layout directives
differential pair; differential pair class DIFFPAIR_CLASS_120; net class RS485_CLASS; rule Matched Net Lengths [Tolerance = 0.5mm]: MOD_RX_N_7, MOD_RX_O_N_7, MOD_RX_O_P_7, MOD_RX_P_7, MOD_TX_N_7, MOD_TX_O_N_7, MOD_TX_O_P_7, MOD_TX_P_7

### Notes on the sheet
- RS422 POINT TO POINT
- Sheild polygon only under RJ45 and near, and connect to EARTH
- RS-422
- Place pull-ups resistor near ESP32/MCU
- (near R21) NF
- (near R22) NF
- (near R23) NF
- GALVANIC ISOLATION
- (near R24) NF
- (near R20) NF
- (near R20) Half-duplex RS-485 (2-wire)
  -----------------------------------
  Uses one differential pair + a reference/ground.
  RJ45 (568B colors):
  1 (W-Orange) → DATA+ (B / D+)
  2 (Orange) → DATA−(A / D−)
  7 (W-Brown) → GND (signal/common)
  8 (Brown) → Shield/Drain (to chassis at entry)
  Pins 3–6 unused (reserve for future or power).
  Full-duplex RS-422 (4-wire)
  ----------------------------------
  Two differential pairs (TX and RX) + ground + shield.
  RJ45 (568B colors):
  1 (W-Orange) → TX+
  2 (Orange) → TX−
  3 (W-Green) → RX+
  6 (Green) → RX−
  7 (W-Brown) → GND (signal/common)
  8 (Brown) → Shield/Drain (to chassis)
  Pins 4–5 (Blue pair) left free (or optional power).
- @{"Id":"EGGGLJBY\DXVZFUCR"} Place SM712 as close to the transceiver pins (A/B) as possible.
  Route from: Transceiver(MAX3485) → SM712 → CM filter → Connector.
  For more info, see https://docs.google.com/document/d/1p_Gc2K1PNFUPMUXlGrvFUq6vTl6wSFHYz2ES-1X6jJA/edit?userstoinvite=nadim.waltonpcb@gmail.com&sharingaction=manageaccess&role=writer&tab=t.tk86ssh51h0y
- DWG. NO.
- REV.
- SHT.
- THIS DOCUMENT AND THE DATA DISCLOSED HEREIN OR HEREWITH IS THE PROPERTY OF ALTIUM LIMITED AND MAY BE FREELY DISTRIBUTED IN WHOLE. NO RIGHTS ARE RESERVED OR EXPRESS OR IMPLIED WARANTEE GIVEN.
- REVISION
- DESCRIPTION
- DATE
- APPROVED
- ENG:
- APPROVALS
- PROJECT
- DSN:
- CHK:
- REFERENCE DOCUMENTS
- PROJECT REVISION:
- TITLE
- DOCUMENT REVISION:
- DESIGN ITEM:
- BOM:
- FAB DWG:
- PCB DWG:
- ASSY DWG:
- SCALE:
- SIZE
- B
- CAGE CODE
- FILE NAME
- DWG NO.
- SHEET
- OF
- REV
- (in symbol 0603WAF1002T5E) 10K-0603
- (in symbol 0603WAF1200T5E) 120R-0603
- (in symbol 1206W4F1004T5E) 1M-1206
- (in symbol B0303S-1WR3) ISOLATION; DC
- (in symbol CL10A106MA8NRNC) 25v; 0603; 10u
- (in symbol CL10B104KC8NNNC) 100v; 0603; 100n
- (in symbol CL31A106KBHNNNE) 50v; 1206; 10u
- (in symbol CL31B475KBHNNNE) 50v; 1206; 4.7u
- (in symbol DLW21SZ900HQ2L) muRata
- (in symbol G08F1E222MN0B0S0N0) 2.2n; 250v; Safety Cap
- (in symbol ISO1410DWR) 3-5V; GALVANIC ISOLATION; TI
- (in symbol SM712(UMW)) TVS; UMW; 7V

### Library data of the parts
C25 C27 = CL10B104KC8NNNC: as C53 on sheet RS485_MODBUS; LCSC Part #: C15725; Unit Price: 0.0036; ComponentLink1Description: DS; ComponentLink1URL: https://www.lcsc.com/datasheet/C15725.pdf
C26 C28 = CL10A106MA8NRNC: CAP: CER 10UF 25V X5R 0603; LCSC Part #: C96446; Unit Price: 0.01; ComponentLink1Description: DS; ComponentLink1URL: https://www.lcsc.com/datasheet/C96446.pdf
C29 = CL31B475KBHNNNE: CAP: CER 4.7UF 50V X7R 1206; LCSC Part #: C51205; Unit Price: 0.0177
C30 = CL31A106KBHNNNE: CAP: CER 10UF 35V X5R 1206; LCSC Part #: C13585; Unit Price: 0.0177
CY1 = G08F1E222MN0B0S0N0: CAP SAFETY: 2.2nF ±20% 250V TH P7.5mm; POC Price: 0.0416; LCSC Part #: C240878; Unit Price: 0.0201; ComponentLink1Description: DS; ComponentLink1URL: https://www.lcsc.com/datasheet/C240878.pdf
D1 D2 = SM712(UMW): as D8 on sheet RS485_MODBUS; LCSC Part #: C7436899; Unit Price: 0.0183; ComponentLink1Description: DS; ComponentLink1URL: https://www.lcsc.com/datasheet/C7436899.pdf
J14 = KH-56-8P8C-1X2-D_1: as J14 on sheet RS485_MODBUS; LCSC Part #: C2828088; Unit Price: 0.3505; ComponentLink1Description: DS; ComponentLink1URL: https://www.lcsc.com/datasheet/C2828088.pdf
L1 L2 = DLW21SZ900HQ2L: as L5 on sheet RS485_MODBUS; LCSC Part #: C161093; Unit Price: 0.0475; ComponentLink1Description: DS; ComponentLink1URL: https://www.lcsc.com/datasheet/C161093.pdf
R19 = 1206W4F1004T5E: RES: 1M OHM 1% 1/4W / 1206; POC Price: 0.0028; LCSC Part #: C17927; Unit Price: 0.0014; ComponentLink1Description: DS; ComponentLink1URL: https://www.lcsc.com/datasheet/C17927.pdf
R20-R23 = 0603WAF1002T5E: RES: 10K OHM 1% 100mW 0603 75V; LCSC Part #: C25804; Unit Price: 0.0005; ComponentLink1Description: DS; ComponentLink1URL: https://www.lcsc.com/datasheet/C25804.pdf
R24 R25 = 0603WAF1200T5E: RES: 120R OHM 1% 100mW 0603 75V; LCSC Part #: C22787; Unit Price: 0.0006; ComponentLink1Description: DS; ComponentLink1URL: https://www.lcsc.com/datasheet/C22787.pdf
TP13 TP14 = Test Pad: TESTPAD: Test Pad
U4 = ISO1410DWR: as U9 on sheet RS485_MODBUS; LCSC Part #: C2671566; Unit Price: 2.1999; ComponentLink1Description: DS; ComponentLink1URL: https://www.ti.com/lit/ds/symlink/iso1410.pdf?ts=1756305081744&ref_url=https%253A%252F%252Fwww.ti.com%252Fproduct%252FISO1410%252Fpart-details%252FISO1410DWR
U5 = B0303S-1WR3: SMPS ISO: DC-DC modular power supply, 1W, fixed voltage input, isolated non-regulated single-channel output SIP,11.7x6mm; POC Price: 0.8117; LCSC Part #: C7465185; Unit Price: 0.4797; ComponentLink1Description: DS; ComponentLink1URL: https://www.lcsc.com/datasheet/C7465185.pdf

## Sheet NOR_FLASH.SchDoc
size A; SheetNumber: 9; SheetTotal: 10
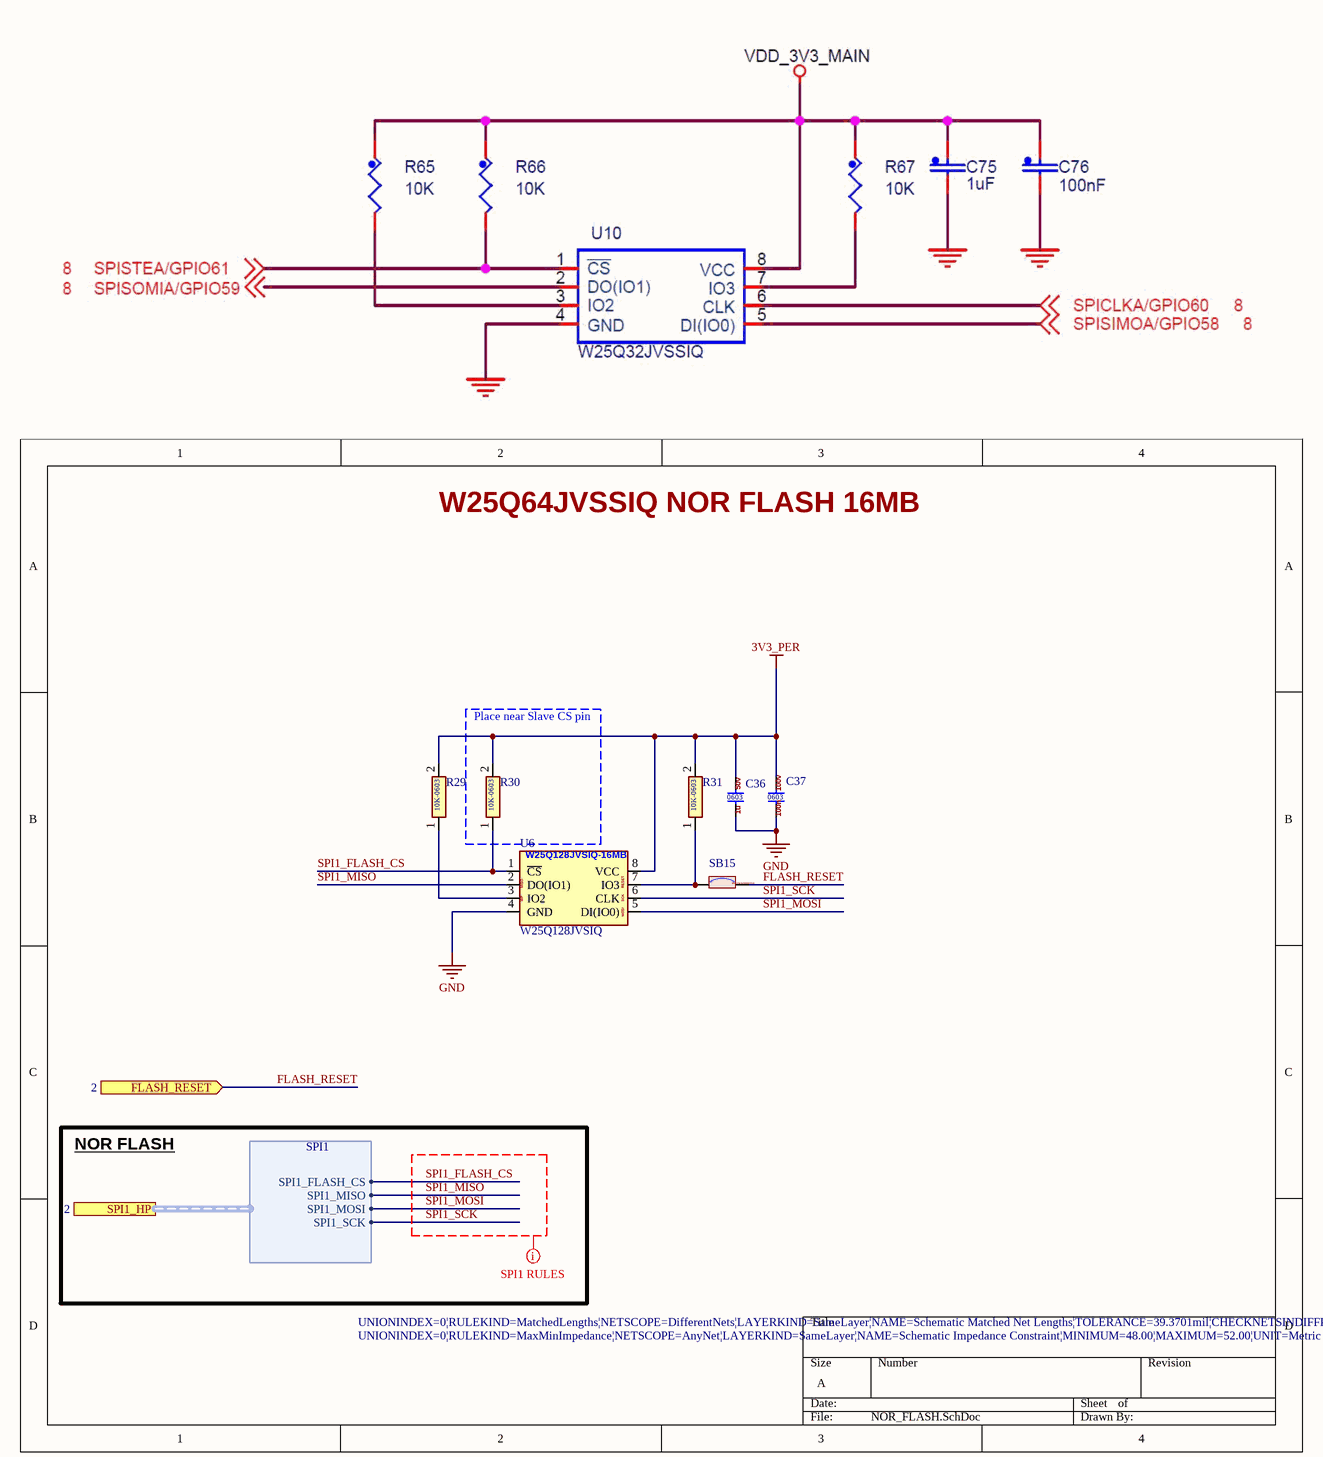
[diagram p8: NOR_FLASH.SchDoc]

### Parts
C36  CL10A105KB8NNNC  [0603-CAP]  (value not drawn)
C37  CL10B104KC8NNNC  [0603-CAP]  (value not drawn)
R29  0603WAF1002T5E  [0603-RES]  (value not drawn)
R30  0603WAF1002T5E  [0603-RES]  (value not drawn)
R31  0603WAF1002T5E  [0603-RES]  (value not drawn)
SB15  0603WAF0000T5E  [SOLDER-BRIDGE_R0603-0R]  (value not drawn)
U6  W25Q128JVSIQ  [SOIC-8N]

### Blocks framed on the sheet
Place near Slave CS pin: R30

### Ports
FLASH_RESET (in, see 2), SPI1_HP (harness SPI1, see 2)

### Harnesses
SPI1: SPI1_FLASH_CS, SPI1_MISO, SPI1_MOSI, SPI1_SCK

### Nets
3V3_PER: C36.2 C37.2 R29.2 R30.2 R31.2 U6.8(VCC)  [project net 3V3_MCU]
GND: C36.1 C37.1 U6.4(GND)
FLASH_RESET: SB15.1 ; port FLASH_RESET
SPI1_FLASH_CS: R30.1 U6.1(~{CS}) ; port SPI1_HP.SPI1_FLASH_CS
SPI1_MISO: U6.2(DO(IO1)) ; port SPI1_HP.SPI1_MISO
SPI1_MOSI: U6.5(DI(IO0)) ; port SPI1_HP.SPI1_MOSI
SPI1_SCK: U6.6(CLK) ; port SPI1_HP.SPI1_SCK
NetR29_1: R29.1 U6.3(IO2)
NetR31_1: R31.1 SB15.2 U6.7(IO3)

### Layout directives
rule Matched Net Lengths [Tolerance = 1mm]; rule Impedance Constraint [Min = 48.00    Max = 52.00    ]; net class SPI1_CLASS: SPI1_FLASH_CS, SPI1_MISO, SPI1_MOSI, SPI1_SCK

### Notes on the sheet
- W25Q64JVSSIQ NOR FLASH 16MB
- NOR FLASH
- (in symbol 0603WAF1002T5E) 10K-0603
- (in symbol CL10A105KB8NNNC) 50v; 0603; 1u
- (in symbol CL10B104KC8NNNC) 100v; 0603; 100n
- (in symbol W25Q128JVSIQ) W25Q128JVSIQ-16MB; MISO; RESET; WP; SCK; MOSI

### Library data of the parts
C36 = CL10A105KB8NNNC: CAP: CER 1UF 50V X5R 0603; LCSC Part #: C15849; Unit Price: 0.0026
C37 = CL10B104KC8NNNC: as C53 on sheet RS485_MODBUS; LCSC Part #: C15725; Unit Price: 0.0036; ComponentLink1Description: DS; ComponentLink1URL: https://www.lcsc.com/datasheet/C15725.pdf
R29-R31 = 0603WAF1002T5E: RES: 10K OHM 1% 100mW 0603 75V; LCSC Part #: C25804; Unit Price: 0.0005; ComponentLink1Description: DS; ComponentLink1URL: https://www.lcsc.com/datasheet/C25804.pdf
SB15 = 0603WAF0000T5E: Solder Bridge: ON SB 0603; LCSC Part #: C21189; Unit Price: 0.0006; ComponentLink1Description: DS; ComponentLink1URL: https://www.lcsc.com/datasheet/C21189.pdf
U6 = W25Q128JVSIQ: Flash: 128Mbit SPI 133MHz SOIC-8-208mil NOR FLASH ROHS; POC Price: 1.2147; LCSC Part #: C97521; Unit Price: 0.8016; ComponentLink1Description: DS; ComponentLink1URL: https://www.lcsc.com/datasheet/C97521.pdf

## Sheet Peripherals.SchDoc
size A3; SheetNumber: 3; SheetTotal: 10
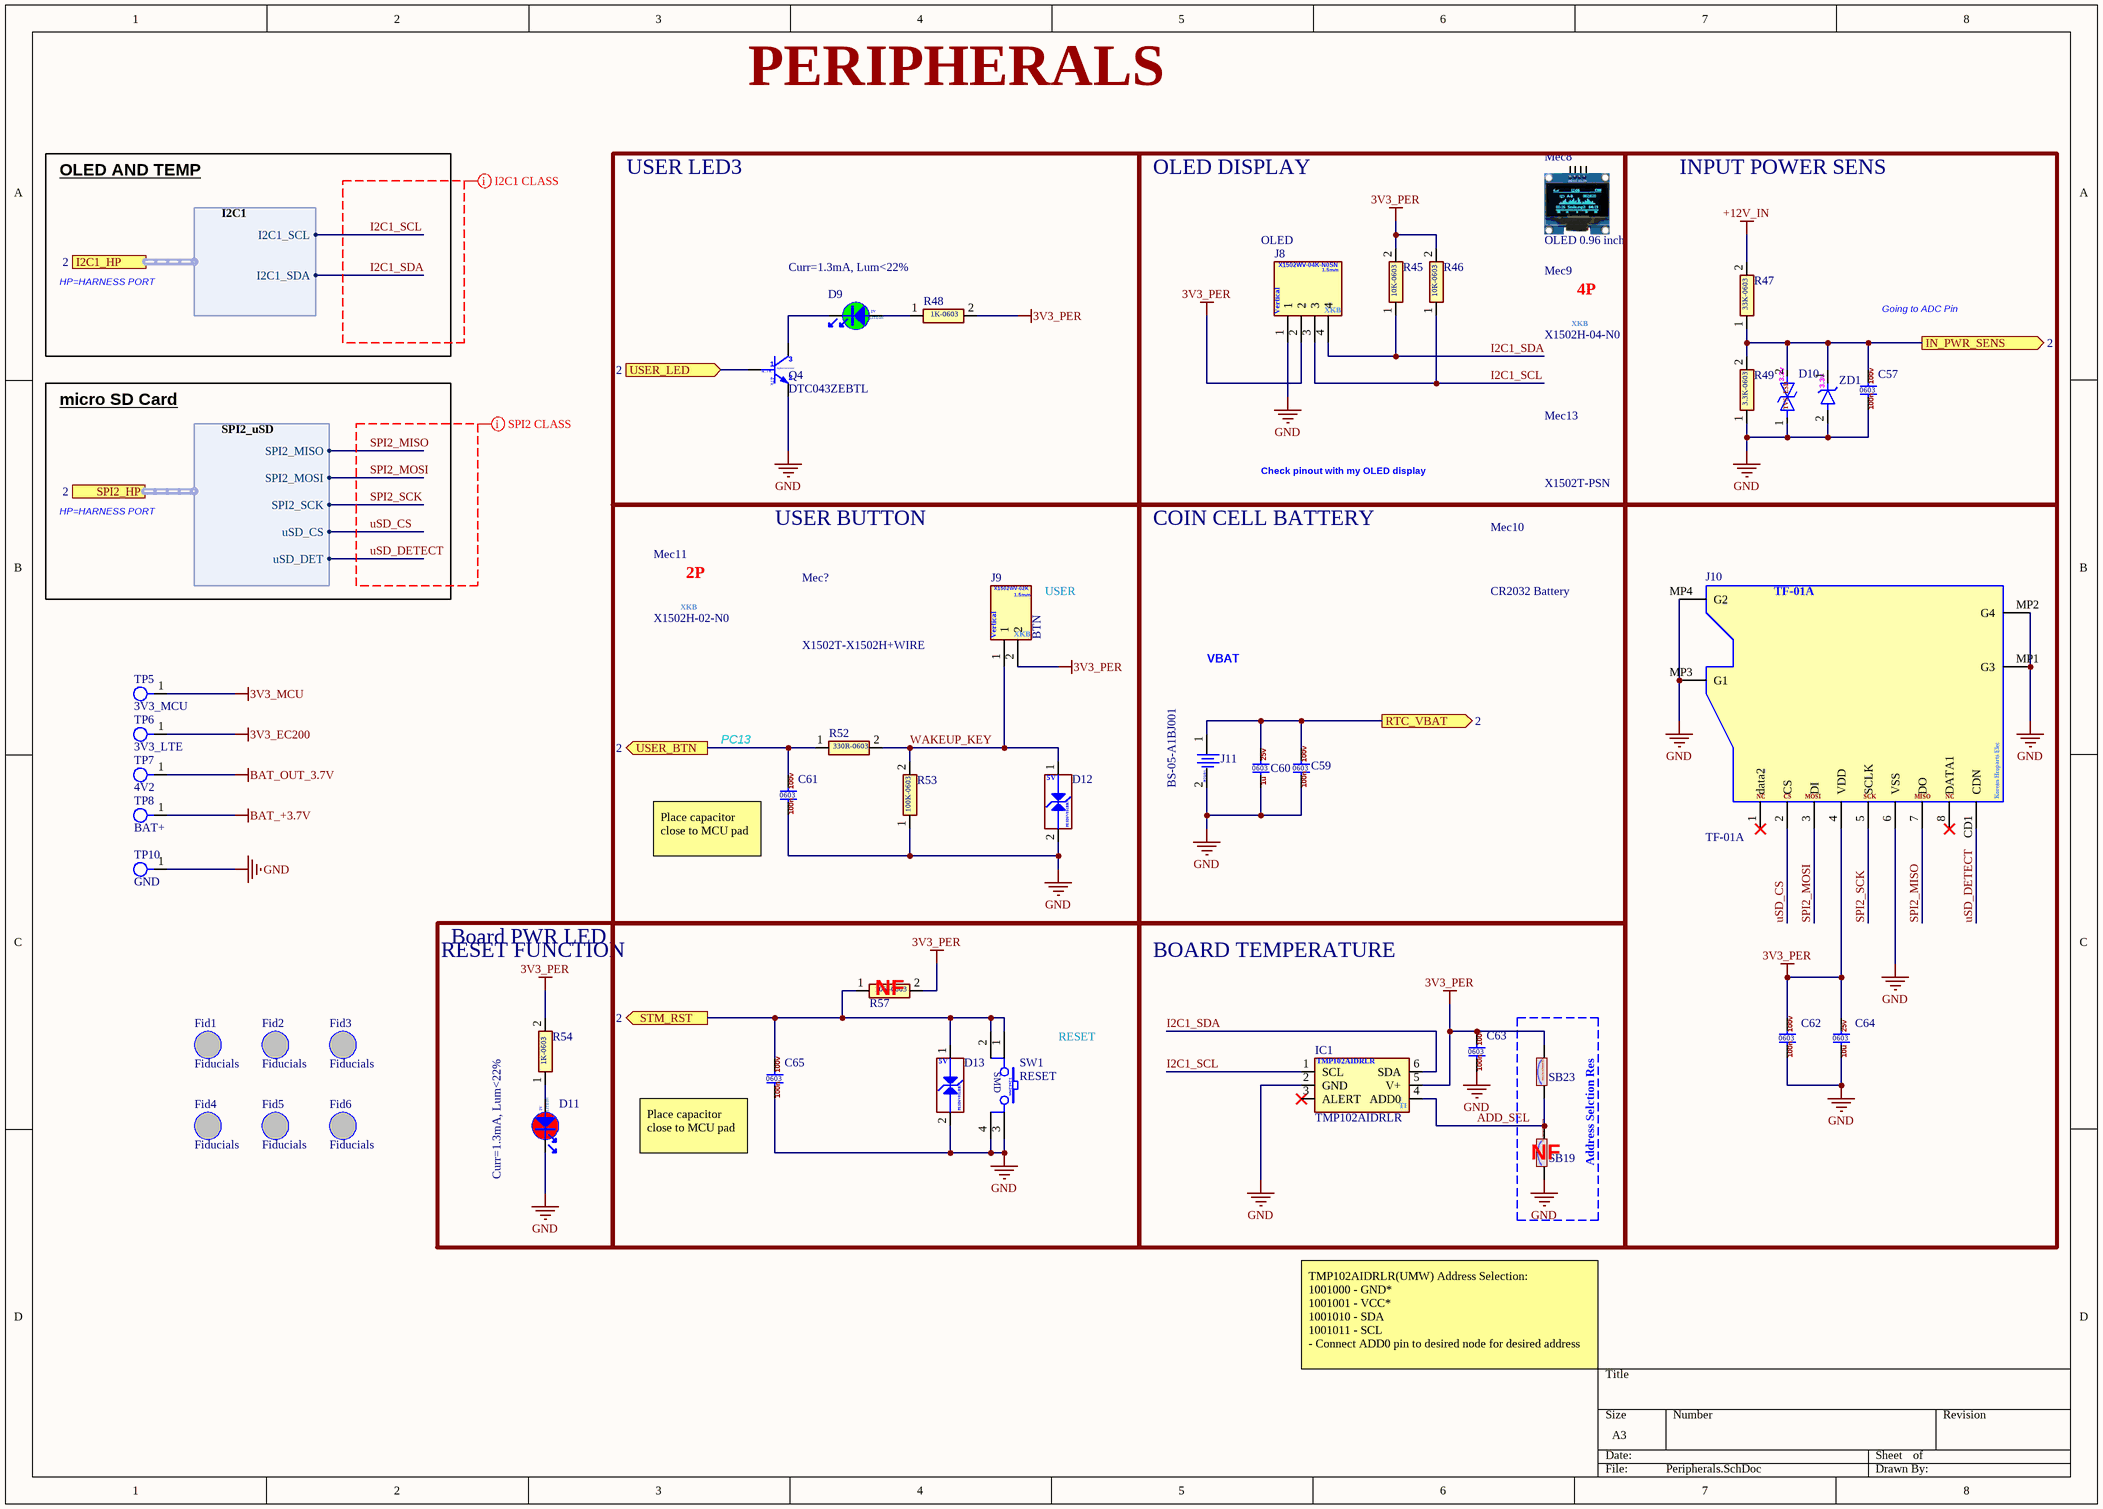
[diagram p9: Peripherals.SchDoc]

### Parts
(Parts that share a designator on the sheet are numbered #1, #2 ... from top to bottom, then left to right.)
C57  CL10B104KC8NNNC  [0603-CAP]  (value not drawn)
C59  CL10B104KC8NNNC  [0603-CAP]  (value not drawn)
C60  CL10B105KA8NNNC  [0603-CAP]  (value not drawn)
C61  CL10B104KC8NNNC  [0603-CAP]  (value not drawn)
C62  CL10B104KC8NNNC  [0603-CAP]  (value not drawn)
C63  CL10B104KC8NNNC  [0603-CAP]  (value not drawn)
C64  CL10A106MA8NRNC  [0603-CAP]  (value not drawn)
C65  CL10B104KC8NNNC  [0603-CAP]  (value not drawn)
D9  LTST-C170KGKT  [0805-LED-BLUE]  (value not drawn)
D10  UDD32C03L01  [SOD-323-2]  (value not drawn)
D11  LTST-C170KRKT  [0805-LED-RED]  (value not drawn)
D12  PESD5V0S1BBN  [SOD-523 SOD2512X110N]  (value not drawn)
D13  PESD5V0S1BBN  [SOD-523 SOD2512X110N]  (value not drawn)
Fid1  Fiducials  [Fiducials]
Fid2  Fiducials  [Fiducials]
Fid3  Fiducials  [Fiducials]
Fid4  Fiducials  [Fiducials]
Fid5  Fiducials  [Fiducials]
Fid6  Fiducials  [Fiducials]
IC1  TMP102AIDRLR  [SOT-563]
J8  OLED  [JST 4P 1.5MM VERTICAL]
J9  BTN  [JST 2P 1.5MM VERTICAL]
J10  TF-01A  [TF-01A]
J11  BS-05-A1BJ001  [BAT-TH_BS-05-A1BJ001]
Mec8  OLED 0.96 inch  (mechanical)
Mec9  X1502H-04-N0  (mechanical)
Mec10  CR2032 Battery  (mechanical)
Mec11  X1502H-02-N0  (mechanical)
Mec13  X1502T-PSN  (mechanical)
Mec?#3  X1502T-X1502H+WIRE  (mechanical)
Q4  DTC043ZEBTL  [SOT-416FL]
R45  0603WAF1002T5E  [0603-RES]  (value not drawn)
R46  0603WAF1002T5E  [0603-RES]  (value not drawn)
R47  0603WAF3302T5E  [0603-RES]  (value not drawn)
R48  0603WAF1001T5E  [0603-RES]  (value not drawn)
R49  0603WAF3301T5E  [0603-RES]  (value not drawn)
R52  0603WAF3300T5E  [0603-RES]  (value not drawn)
R53  0603WAF1003T5E  [0603-RES]  (value not drawn)
R54  0603WAF1001T5E  [0603-RES]  (value not drawn)
R57  0603WAF1002T5E  [0603-RES]  (value not drawn)
SB19  0603WAF0000T5E  [SOLDER-BRIDGE_R0603-0R]  (value not drawn)
SB23  0603WAF0000T5E  [SOLDER-BRIDGE_R0603-0R]  (value not drawn)
SW1  RESET  [SW TACTILE 4P]
TP5  3V3_MCU  [Test Pad FP]
TP6  3V3_LTE  [Test Pad FP]
TP7  4V2  [Test Pad FP]
TP8  BAT+  [Test Pad FP]
TP10  GND  [Test Pad FP]
ZD1  BZT52C3V3  [SOD-123F-2]  (value not drawn)

### Blocks framed on the sheet
USER LED3: D9 Q4 R48
OLED DISPLAY: J8 Mec8 Mec9 Mec13 R45 R46
INPUT POWER SENS: C57 D10 R47 R49 ZD1
USER BUTTON: C61 D12 J9 Mec11 Mec?#3 R52 R53
COIN CELL BATTERY: C59 C60 J11 Mec10
Board PWR LED: D11 R54
BOARD TEMPERATURE: C63 IC1
NF: SB19 SB23

### Ports
I2C1_HP (harness I2C1, see 2), IN_PWR_SENS (out, see 2), RTC_VBAT (out, see 2), SPI2_HP (harness SPI2_uSD, see 2), STM_RST (out, see 2), USER_BTN (out, see 2), USER_LED (in, see 2)

### Harnesses
I2C1: I2C1_SCL, I2C1_SDA
SPI2_uSD: uSD_CS, SPI2_MISO, SPI2_MOSI, SPI2_SCK, uSD_DET

### Nets
3V3_EC200: TP6.1
3V3_MCU: C62.2 C63.2 C64.2 IC1.5(V+) J8.2 J9.2 J10.4(VDD) R45.2 R46.2 R48.2 R54.2 R57.2 SB23.2 TP5.1  [also labelled 3V3_PER]
+12V_IN: R47.2
BAT_+3.7V: TP8.1
BAT_OUT_3.7V: TP7.1
GND: C57.1 C59.1 C60.1 C61.1 C62.1 C63.1 C64.1 C65.1 D10.1(K) D11.2 D12.2(GND) D13.2(GND) IC1.2(GND) J8.1 J10.6(VSS) J10.MP1(G3) J10.MP2(G4) J10.MP3(G1) J10.MP4(G2) J11.2 Q4.2(E) R49.1 R53.1 SB19.2 SW1.3 SW1.4 TP10.1 ZD1.2
ADD_SEL: IC1.4(ADD0) SB19.1 SB23.1  [project net ADD_SEL_3]
I2C1_SCL: IC1.1(SCL) J8.3 R46.1 ; port I2C1_HP.I2C1_SCL
I2C1_SDA: IC1.6(SDA) J8.4 R45.1 ; port I2C1_HP.I2C1_SDA
IN_PWR_SENS: C57.2 D10.2(A) R47.1 R49.2 ZD1.1 ; port IN_PWR_SENS
RTC_VBAT: C59.2 C60.2 J11.1 ; port RTC_VBAT
SPI2_MISO: J10.7(DO) ; port SPI2_HP.SPI2_MISO
SPI2_MOSI: J10.3(DI) ; port SPI2_HP.SPI2_MOSI
SPI2_SCK: J10.5(SCLK) ; port SPI2_HP.SPI2_SCK
STM_RST: C65.2 D13.1(IO1) R57.1 SW1.1 SW1.2 ; port STM_RST
uSD_CS: J10.2(CS) ; port SPI2_HP.uSD_CS
uSD_DETECT: J10.CD1(CDN) ; port SPI2_HP.uSD_DET
USER_BTN: C61.2 R52.1 ; port USER_BTN
USER_LED: Q4.1(B) ; port USER_LED
WAKEUP_KEY: D12.1(IO1) J9.1 R52.2 R53.2  [project net WAKEUP_KEY_3]
NetD9_1: D9.1 R48.1
NetD9_2: D9.2 Q4.3(C)
NetD11_1: D11.1 R54.1

Not connected (* = marked no-connect by the designer): IC1 3(ALERT)*; J10 1(data2)* 8(DATA1)*

### Layout directives
net class SPI2_CLASS; rule Matched Net Lengths [Tolerance = 19.685mil]: SPI2_MISO, SPI2_MOSI, SPI2_SCK, uSD_CS, uSD_DETECT
net class I2C1_CLASS; rule Matched Net Lengths [Tolerance = 19.685mil]: I2C1_SCL, I2C1_SDA

### Notes on the sheet
- PERIPHERALS
- OLED AND TEMP
- HP=HARNESS PORT
- Curr=1.3mA, Lum<22%
- Going to ADC Pin
- micro SD Card
- Check pinout with my OLED display
- (near J9) USER
- VBAT
- PC13
- (near C61) Place capacitor close to MCU pad
- RESET FUNCTION
- (near R57) NF
- RESET
- (near C65) Place capacitor close to MCU pad
- Address Selction Res
- TMP102AIDRLR(UMW) Address Selection:
  1001000 - GND*
  1001001 - VCC*
  1001010 - SDA
  1001011 - SCL
  - Connect ADD0 pin to desired node for desired address
- (in symbol 0603WAF1001T5E) 1K-0603
- (in symbol 0603WAF1002T5E) 10K-0603
- (in symbol 0603WAF1003T5E) 100K-0603
- (in symbol 0603WAF3300T5E) 330R-0603
- (in symbol 0603WAF3301T5E) 3.3K-0603
- (in symbol 0603WAF3302T5E) 33K-0603
- (in symbol BS-05-A1BJ001) Vertical
- (in symbol BZT52C3V3) 3.3v
- (in symbol CL10A106MA8NRNC) 25v; 0603; 10u
- (in symbol CL10B104KC8NNNC) 100v; 0603; 100n
- (in symbol CL10B105KA8NNNC) 25v; 0603; 1u
- (in symbol DTC043ZEBTL) digital transistor; 4.7k; 47k
- (in symbol LTST-C170KGKT) 2V; LITEON
- (in symbol LTST-C170KRKT) 2V; LITEON
- (in symbol PESD5V0S1BBN) 5V
- (in symbol TF-01A) NC; MOSI; SCK; MISO; Korean Hroparts Elec
- (in symbol TMP102AIDRLR) TI
- (in symbol TS-1145A-B-A) SMD; 3.2x4.2mm
- (in symbol UDD32C03L01) 3.3v; ESD; TVS
- (in symbol X1502H-02-N0) 2P; XKB
- (in symbol X1502H-04-N0) 4P; XKB
- (in symbol X1502WV-02K-N0SN) X1502WV-02K; 1.5mm; Vertical; XKB
- (in symbol X1502WV-04K-N0SN) 1.5mm; Vertical; XKB

### Library data of the parts
C57 C59 C61-C63 C65 = CL10B104KC8NNNC: as C53 on sheet RS485_MODBUS; LCSC Part #: C15725; Unit Price: 0.0036; ComponentLink1Description: DS; ComponentLink1URL: https://www.lcsc.com/datasheet/C15725.pdf
C60 = CL10B105KA8NNNC: CAP: CER 1UF 25V X7R 0603; LCSC Part #: C29936; Unit Price: 0.0027; ComponentLink1Description: DS; ComponentLink1URL: https://www.lcsc.com/datasheet/C29936.pdf
C64 = CL10A106MA8NRNC: CAP: CER 10UF 25V X5R 0603; LCSC Part #: C96446; Unit Price: 0.01; ComponentLink1Description: DS; ComponentLink1URL: https://www.lcsc.com/datasheet/C96446.pdf
D9 = LTST-C170KGKT: LED: GREEN 20mA 35mcd Water Clear -55℃~+85℃ 571nm Yellow Green 130° 75mW 2V 0805 LED Indication - Discrete ROHS; POC Price: 0.0216; LCSC Part #: C98221; Unit Price: 0.0095; ComponentLink1Description: DS; ComponentLink1URL: https://www.lcsc.com/datasheet/C98221.pdf
D10 = UDD32C03L01: DIODE TVS: 3.3V 19A 15V 4V BidirectionalESD and Surge Protection (TVS/ESD) ROHS  SOD-323; POC Price: 0.0344; LCSC Part #: C78439; Unit Price: 0.0172; ComponentLink1Description: DS; ComponentLink1URL: https://www.lcsc.com/datasheet/C78439.pdf
D11 = LTST-C170KRKT: LED: RED 20mA 54mcd Colorless Transparent Lens -55℃~+85℃ 631nm Red 130° 75mW 2V 0805 LED; POC Price: 0.0229; LCSC Part #: C94868; Unit Price: 0.0107
D12 D13 = PESD5V0S1BBN: DIODE ESD: 5A 75W@8/20us 15V 6V Bidirectional 5V SOD-523 ESD and Surge Protection (TVS/ESD); POC Price: 0.0232; LCSC Part #: C314264; Unit Price: 0.0106; ComponentLink1Description: DS; ComponentLink1URL: https://www.lcsc.com/datasheet/C314264.pdf
IC1 = TMP102AIDRLR: SEN: TEMP TI TMP102AIDRLR Temperature sensor / SOT-563; POC Price: 0.2045; LCSC Part #: C99269; Unit Price: 0.1007; ComponentLink1Description: DS; ComponentLink1URL: https://www.lcsc.com/datasheet/C99269.pdf
J8 = X1502WV-04K-N0SN: JST: Vertical, P1.5mm TH, 4P, Wire To Board Connector, 1A (Housing: X1502H-04-N0 - C697055); POC Price: 0.0307; LCSC Part #: C561527; Unit Price: 0.0141; ComponentLink1Description: DS; ComponentLink1URL: https://www.lcsc.com/datasheet/C561527.pdf
J9 = X1502WV-02K-N0SN: JST: Vertical, P1.5mm TH, 2P, Wire To Board Connector, 1A (Housing: X1502H-02-N0 - C697053); POC Price: 0.0156; LCSC Part #: C561525; Unit Price: 0.0071; ComponentLink1Description: DS; ComponentLink1URL: https://www.lcsc.com/datasheet/C561525.pdf
J10 = TF-01A: Micro-sd card: 1.85mm Connector and Ejector MicroSD Card (TF Card) Push-Push SMD SD Card / Memory Card Connector ROHS; POC Price: 0.1724; ComponentLink1Description: DS; ComponentLink1URL: https://www.lcsc.com/datasheet/C91145.pdf; LCSC Part #: C91145; Unit Price: 0.0922
J11 = BS-05-A1BJ001: Battery Con: CR2032, RTC, Connector, Vertical; POC Price: 0.1585; LCSC Part #: C964752; Unit Price: 0.0766; ComponentLink1Description: DS; ComponentLink1URL: https://www.lcsc.com/datasheet/C964752.pdf
Mec8 = OLED 0.96 inch: OLED: OLED 0.96 inch LED, DISPLAY; POC Price: 2.2; ComponentLink1Description: Purchase link; ComponentLink1URL: https://store.roboticsbd.com/arduino-shield/1328-096-inch-i2c-oled-display-white-robotics-bangladesh.html?srsltid=AfmBOoov87Sur0oLopDQguXRmOqb7O4VOpYo566uxhe8bvAyIzZHciV9; Unit Price: 1.2
Mec9 = X1502H-04-N0: JST Housing: P1.5mm, 4P, Wire To Board; POC Price: 0.0139; LCSC Part #: C697055; Unit Price: 0.0063; ComponentLink1Description: DS; ComponentLink1URL: https://www.lcsc.com/datasheet/C697055.pdf
Mec10 = CR2032 Battery: POC Price: 0.4; ComponentLink1Description: Purchase Link; ComponentLink1URL: https://techshopbd.com/product/lithium-battery-maxell-cr2032; Unit Price: 0.25
Mec11 = X1502H-02-N0: JST Housing: P1.5mm, 2P, Wire To Board; POC Price: 0.0042; LCSC Part #: C697053; Unit Price: 0.0036; ComponentLink1Description: DS; ComponentLink1URL: https://www.lcsc.com/datasheet/C697053.pdf
Mec13 = X1502T-PSN: Con: Rectangular Connector Contacts ROHS; JST; HOUSING; P1.5mm; 2P; 3P; 4P; WIRE TO BOARD; X1502H; X1503H; X1504H; X1505H; X1506H; X1502T; X1503T; X1504T; X1505T; X1506T; POC Price: 0.005; LCSC Part #: C780064; Unit Price: 0.0024; ComponentLink1Description: DS; ComponentLink1URL: https://www.lcsc.com/datasheet/C780064.pdf
Mec?#3 = X1502T-PSN-A28RB-L100-T3: Hook-Up Wire: Housing+contact; Single Conductor Cables (Hook-Up Wire); JST; HOUSING; P1.5mm; 2P; WIRE TO BOARD; X1502H; X1502T; 28 AWG; POC Price: 0.0789; LCSC Part #: C6118644; Unit Price: 0.0727; ComponentLink1Description: DS
Q4 = DTC043ZEBTL: Transistor digital: 80@10mA,5V 150mW 100mA 50V SOT-416FL Digital Transistors ROHS; LCSC Part #: C96459; Unit Price: 0.0094
R45 R46 R57 = 0603WAF1002T5E: RES: 10K OHM 1% 100mW 0603 75V; LCSC Part #: C25804; Unit Price: 0.0005; ComponentLink1Description: DS; ComponentLink1URL: https://www.lcsc.com/datasheet/C25804.pdf
R47 = 0603WAF3302T5E: RES: 33K OHM 1% 100mW 0603 75V; LCSC Part #: C4216; Unit Price: 0.0006; ComponentLink1Description: DS; ComponentLink1URL: https://www.lcsc.com/datasheet/C4216.pdf
R48 R54 = 0603WAF1001T5E: RES: 1K OHM 1% 100mW 0603 75V; LCSC Part #: C21190; Unit Price: 0.0005; ComponentLink1Description: DS; ComponentLink1URL: https://www.lcsc.com/datasheet/C21190.pdf
R49 = 0603WAF3301T5E: RES: 3.3K OHM 1% 100mW 0603 75V; POC Price: 0.001; LCSC Part #: C22978; Unit Price: 0.0006; ComponentLink1Description: DS; ComponentLink1URL: https://www.lcsc.com/datasheet/C4216.pdf
R52 = 0603WAF3300T5E: RES: 330 OHM 1% 100mW 0603 75V; POC Price: 0.0011; LCSC Part #: C23138; Unit Price: 0.0006; ComponentLink1Description: DS; ComponentLink1URL: https://www.lcsc.com/datasheet/C23138.pdf
R53 = 0603WAF1003T5E: RES: 100K OHM 1% 100mW 0603 75V; LCSC Part #: C25803; Unit Price: 0.0006; ComponentLink1Description: DS; ComponentLink1URL: https://www.lcsc.com/datasheet/C25803.pdf
SB19 SB23 = 0603WAF0000T5E: Solder Bridge: ON SB 0603; LCSC Part #: C21189; Unit Price: 0.0006; ComponentLink1Description: DS; ComponentLink1URL: https://www.lcsc.com/datasheet/C21189.pdf
SW1 = TS-1145A-B-A: SW: 3.2mm 2.5mm Oval push button Standing paste SPST SMD Tactile Switches ROHS; POC Price: 0.0495; LCSC Part #: C318904; Unit Price: 0.0242; ComponentLink1Description: DS; ComponentLink1URL: https://www.lcsc.com/datasheet/C318904.pdf
TP5-TP8 TP10 = Test Pad: TESTPAD: Test Pad
ZD1 = BZT52C3V3: DIODE: 3.3V ZENER 3.14V~3.47V 500mW 3.3V SOD-123 Zener Diodes ROHS; POC Price: 0.0129; LCSC Part #: C173413; Unit Price: 0.006; ComponentLink1Description: DS; ComponentLink1URL: https://www.lcsc.com/datasheet/C173413.pdf

## Sheet Power_Budget.SchDoc
size A3 portrait; SheetNumber: 10; SheetTotal: 10
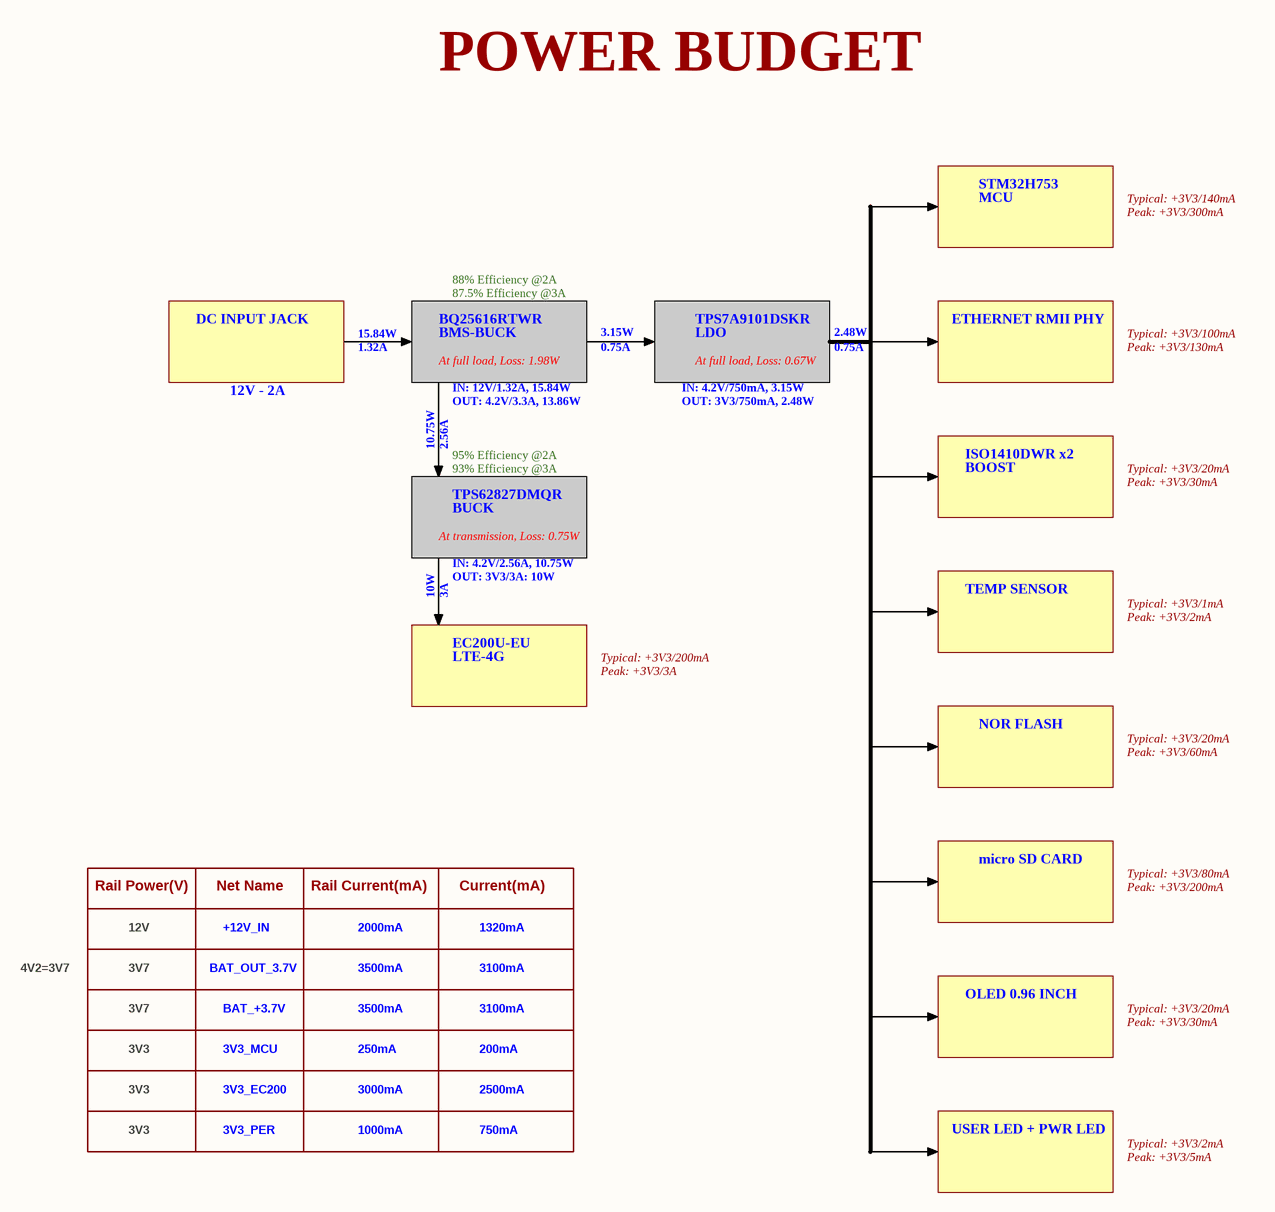
[diagram p10: Power_Budget.SchDoc]

### Notes on the sheet
- POWER BUDGET
- STM32H753
- MCU
- Typical: +3V3/140mA
- Peak: +3V3/300mA
- 88% Efficiency @2A
- DC INPUT JACK
- 15.84W
- 1.32A
- BQ25616RTWR
- BMS-BUCK
- 87.5% Efficiency @3A
- 3.15W
- 0.75A
- TPS7A9101DSKR
- LDO
- 2.48W
- ETHERNET RMII PHY
- Typical: +3V3/100mA
- Peak: +3V3/130mA
- 12V - 2A
- At full load, Loss: 1.98W
- IN: 12V/1.32A, 15.84W
- OUT: 4.2V/3.3A, 13.86W
- OUT: 3V3/750mA, 2.48W
- IN: 4.2V/750mA, 3.15W
- At full load, Loss: 0.67W
- 10.75W
- 2.56A
- 93% Efficiency @3A
- 95% Efficiency @2A
- ISO1410DWR x2
- BOOST
- Typical: +3V3/20mA
- Peak: +3V3/30mA
- At transmission, Loss: 0.75W
- TPS62827DMQR
- BUCK
- 10W
- OUT: 3V3/3A: 10W
- IN: 4.2V/2.56A, 10.75W
- 3A
- TEMP SENSOR
- Typical: +3V3/1mA
- Peak: +3V3/2mA
- EC200U-EU
- LTE-4G
- Typical: +3V3/200mA
- Peak: +3V3/3A
- NOR FLASH
- Peak: +3V3/60mA
- Rail Power(V)
- Net Name
- Rail Current(mA)
- Current(mA)
- micro SD CARD
- Typical: +3V3/80mA
- Peak: +3V3/200mA
- 12V
- +12V_IN
- 2000mA
- 1320mA
- 4V2=3V7
- 3V7
- BAT_OUT_3.7V
- BAT_+3.7V
- 3500mA
- 3100mA
- OLED 0.96 INCH
- 3V3
- 3V3_MCU
- 3V3_EC200
- 250mA
- 3000mA
- 200mA
- 2500mA
- 3V3_PER
- 1000mA
- 750mA
- USER LED + PWR LED
- Typical: +3V3/2mA
- Peak: +3V3/5mA

## Nets that join several sheets
3V3_EC200: miniPCIe_EC200U (12 pins), Power_Board (6 pins), Peripherals (TP6.1)
3V3_MCU: MCU (20 pins), Ethernet (21 pins), Power_Board (FB1.2), RS485_MODBUS (5 pins), RS422_point_to_point (8 pins), NOR_FLASH (6 pins), Peripherals (14 pins)
+3V3_ISO: RS485_MODBUS (C55.2 C56.2 U9.16), RS422_point_to_point (5 pins)
+12V_IN: Power_Board (D7.1 J5.1 Q3.3 U7.1), Peripherals (R47.2)
BAT_+3.7V: Power_Board (5 pins), Peripherals (TP8.1)
BAT_OUT_3.7V: Power_Board (18 pins), Peripherals (TP7.1)
GND: MCU (25 pins), miniPCIe_EC200U (22 pins), Ethernet (26 pins), Power_Board (37 pins), RS485_MODBUS (5 pins), RS422_point_to_point (7 pins), NOR_FLASH (C36.1 C37.1 U6.4), Peripherals (28 pins)
GND_ISO: RS485_MODBUS (6 pins), RS422_point_to_point (10 pins)
GND_SHEILD: RS485_MODBUS (J14.7 J14.8 J14.25), RS422_point_to_point (5 pins)
~{AIRPLANE_MODE}: MCU (SB4.2), miniPCIe_EC200U (J4.20 R12.1)
BAT_VOLT_SENS: MCU (U1.98), Power_Board (C58.2 R50.1 R51.2)
BUCK_3V3_PG: MCU (U1.28), Power_Board (SB3.1)
~{EC200U_RESET}: MCU (SB13.2), miniPCIe_EC200U (J4.22)
EC200U_DETECTION: MCU (SB5.2), miniPCIe_EC200U (R28.1 SB21.2)
EC200U_PWR_EN: MCU (SB10.2), Power_Board (R26.1 U8.1)
EC200U_WAKEUP_IN: MCU (SB14.2), miniPCIe_EC200U (J4.1)
ETH_50MHz_OSC: MCU (U1.23), Ethernet (R11.2 U3.13)
ETH_PWR_DOWN: MCU (U1.17), Ethernet (R17.1 U3.3)
ETH_RESET: MCU (U1.25), Ethernet (SB17.1)
FLASH_RESET: MCU (U1.86), NOR_FLASH (SB15.1)
I2C1_SCL: MCU (U1.95), Peripherals (IC1.1 J8.3 R46.1)
I2C1_SDA: MCU (U1.96), Peripherals (IC1.6 J8.4 R45.1)
IN_PWR_SENS: MCU (U1.97), Peripherals (5 pins)
~{RS485_RE}_DE: MCU (U1.2), RS485_MODBUS (R42.1 U9.4 U9.5)
RMII_CRS_DV: MCU (U1.31), Ethernet (R4.1 U3.20)
RMII_MDC: MCU (U1.16), Ethernet (U3.16)
RMII_MDIO: MCU (U1.24), Ethernet (R5.1 U3.15)
RMII_RXD0: MCU (U1.32), Ethernet (R2.1 U3.18)
RMII_RXD1: MCU (U1.33), Ethernet (R3.1 U3.17)
RMII_RXER_GPIO: MCU (U1.34), Ethernet (SB16.1)
RMII_TX_EN: MCU (U1.47), Ethernet (U3.1)
RMII_TXD0: MCU (U1.51), Ethernet (U3.23)
RMII_TXD1: MCU (U1.52), Ethernet (U3.24)
RS422_DE: MCU (U1.5), RS422_point_to_point (R21.1 U4.5)
RS422_DI: MCU (U1.4), RS422_point_to_point (R20.1 TP14.1 U4.6)
RS422_RE: MCU (U1.7), RS422_point_to_point (R22.1 U4.4)
RS422_RO: MCU (U1.8), RS422_point_to_point (R23.1 TP13.1 U4.3)
RS485_DI: MCU (U1.1), RS485_MODBUS (R41.1 TP12.1 U9.6)
RS485_RO: MCU (U1.3), RS485_MODBUS (R43.1 TP11.1 U9.3)
RTC_VBAT: MCU (U1.6), Peripherals (C59.2 C60.2 J11.1)
SPI1_FLASH_CS: MCU (SB28.2), NOR_FLASH (R30.1 U6.1)
SPI1_MISO: MCU (U1.90), NOR_FLASH (U6.2)
SPI1_MOSI: MCU (SB27.2), NOR_FLASH (U6.5)
SPI1_SCK: MCU (SB26.2), NOR_FLASH (U6.6)
SPI2_MISO: MCU (U1.53), Peripherals (J10.7)
SPI2_MOSI: MCU (U1.54), Peripherals (J10.3)
SPI2_SCK: MCU (U1.46), Peripherals (J10.5)
STM_RST: MCU (U1.14), Peripherals (5 pins)
UART3_CTS: MCU (SB6.2), miniPCIe_EC200U (J4.23)
UART3_DTR: MCU (SB8.2), miniPCIe_EC200U (J4.31)
UART3_RTS: MCU (SB7.2), miniPCIe_EC200U (J4.25)
UART3_RXD: MCU (SB9.2), miniPCIe_EC200U (J4.11)
UART3_TXD: MCU (SB11.2), miniPCIe_EC200U (J4.13)
USB_D_N: MCU (SB2.2), miniPCIe_EC200U (J4.36 TP15.1)
USB_D_P: MCU (SB1.2), miniPCIe_EC200U (J4.38 TP16.1)
uSD_CS: MCU (U1.45), Peripherals (J10.2)
uSD_DETECT: MCU (U1.44), Peripherals (J10.CD1)
USER_BTN: MCU (U1.22), Peripherals (C61.2 R52.1)
USER_LED: MCU (U1.78), Peripherals (Q4.1)

## Assembly variants
V1: not fitted R6 R7 R8 R9 R12 R14 R20 R21 R22 R23 R24 R34 R41 R42 R43 R57 SB12 SB19 SB22 SB25